# EAGLE design CentralLubrication_RevA (EAGLE 7.6.0)

## Sheet 1 of 5
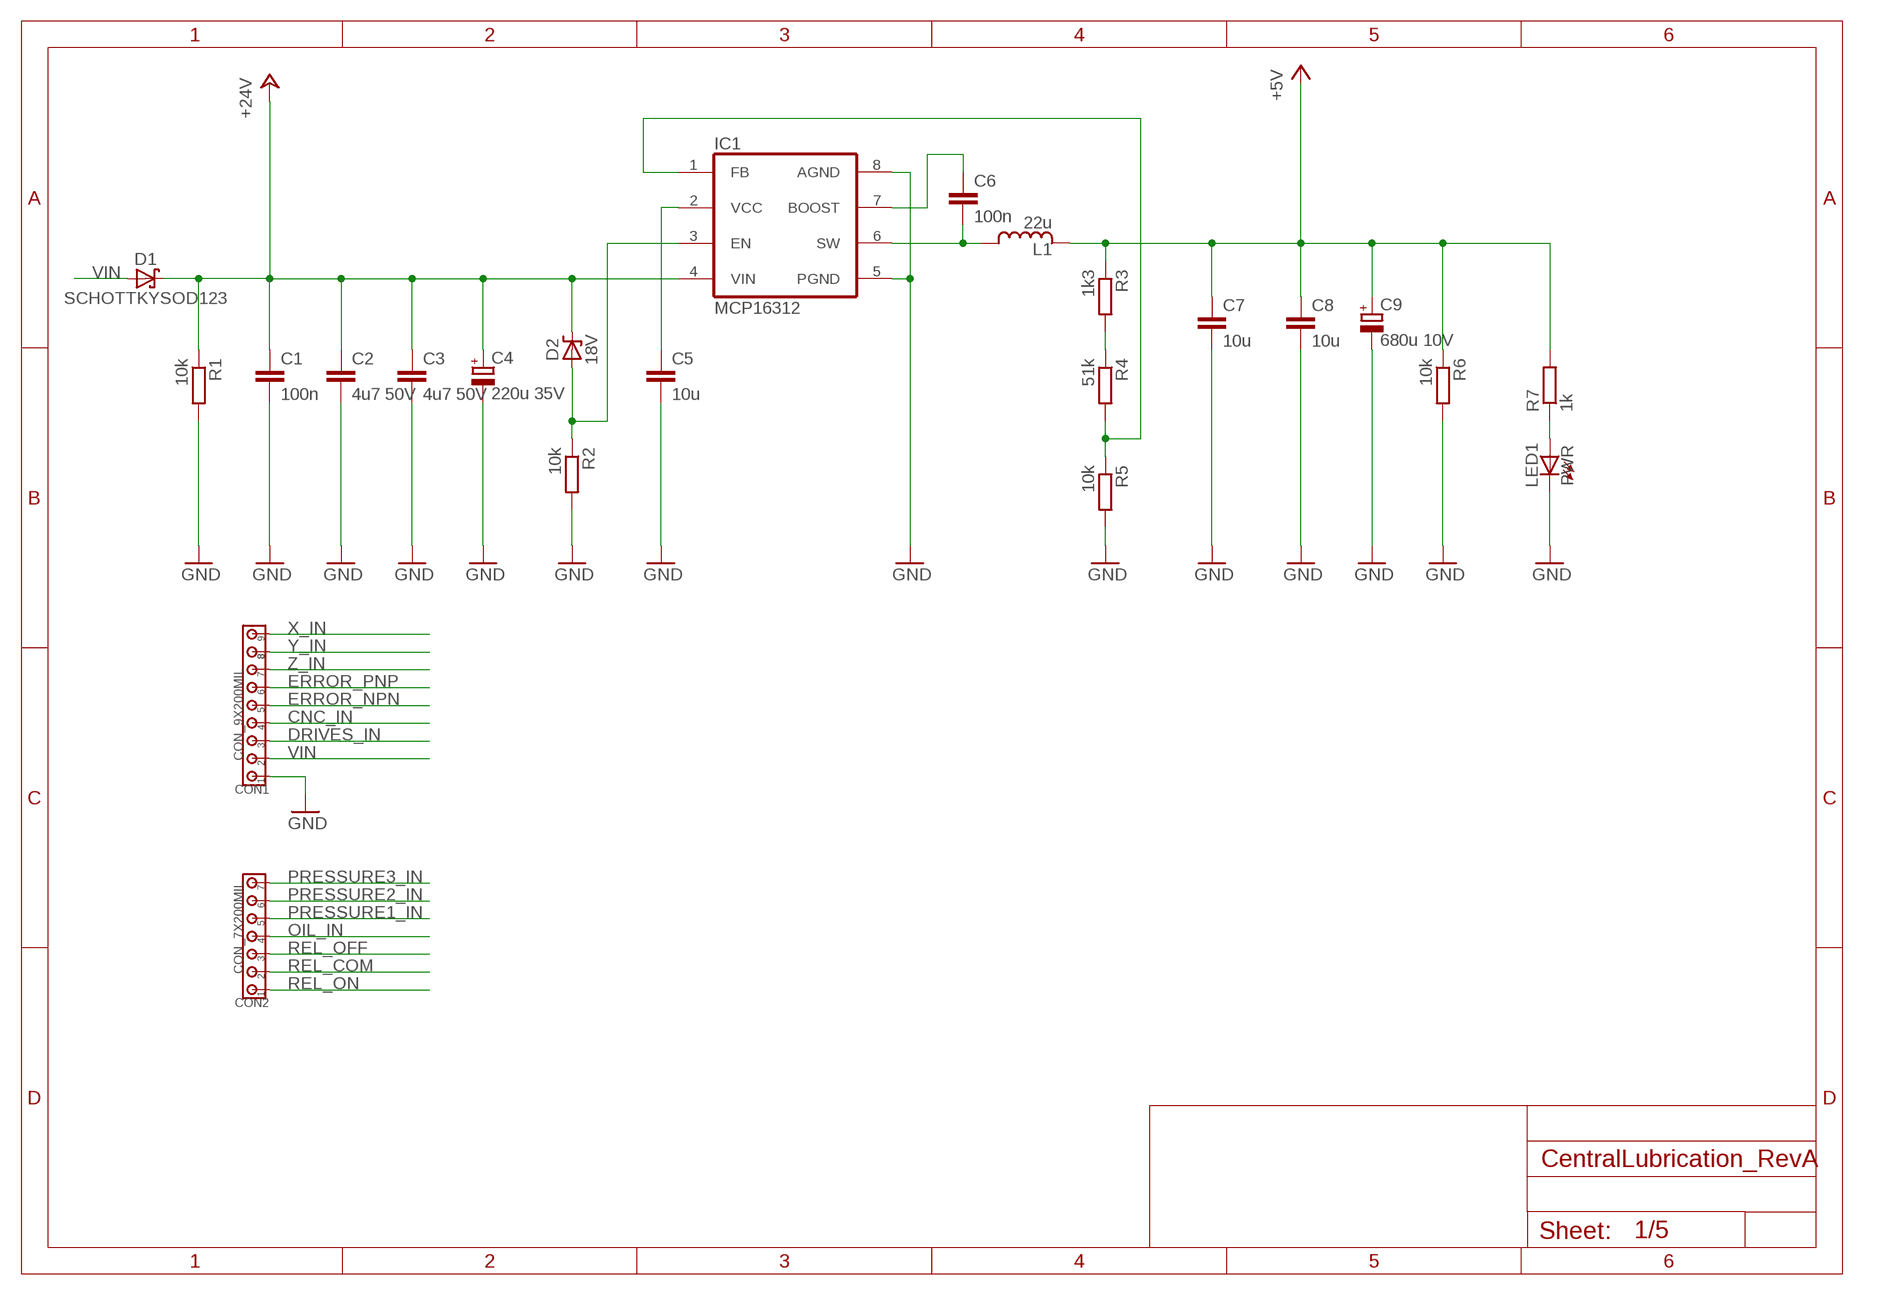
[diagram p0: schematic, sheet 1]

### Parts
C1  100n  CC0805  [C0805]
C2  4u7 50V  CC1206  [C1206]
C3  4u7 50V  CC1206  [C1206]
C4  220u 35V  C_POLARIZED8MM  [8MM]
C5  10u  CC0805  [C0805]
C6  100n  CC0805  [C0805]
C7  10u  CC0805  [C0805]
C8  10u  CC0805  [C0805]
C9  680u 10V  C_POLARIZED8MM  [8MM]
CON1  CON_9X200MIL  [200MIL_9X]
CON2  CON_7X200MIL  [200MIL_7X]
D1  SCHOTTKYSOD123  [SOD123]
D2  18V  ZENERSOD323  [SOD323]
IC1  MCP16312  MCP16311  [MSOP8]
L1  22u  INDUCTORLPS4018  [LPS4018]
LED1  PWR  LED0805_NB  [LED0805_NOBOARDER]
R1  10k  RESISTORR0805  [R0805]
R2  10k  RESISTORR0805  [R0805]
R3  1k3  RESISTORR0805  [R0805]
R4  51k  RESISTORR0805  [R0805]
R5  10k  RESISTORR0805  [R0805]
R6  10k  RESISTORR0805  [R0805]
R7  1k  RESISTORR0805  [R0805]

### Nets
+5V [+5v]: C7.1 C8.1 C9.+ L1.2 R3.1 R6.1 R7.2 ; also sheet 2,3,4,5
+24V [24V]: C1.1 C2.1 C3.1 C4.+ D1.C D2.C IC1.4(VIN) R1.1 ; also sheet 2
BOOST: C6.1 IC1.7(BOOST)
CNC_IN: CON1.4 ; also sheet 5
DRIVES_IN: CON1.3 ; also sheet 5
ERROR_NPN: CON1.5 ; also sheet 2
ERROR_PNP: CON1.6 ; also sheet 2
GND: C1.2 C2.2 C3.2 C4.- C5.2 C7.2 C8.2 C9.- CON1.1 IC1.5(PGND) IC1.8(AGND) LED1.C R1.2 R2.2 R5.2 R6.2 ; also sheet 2,3,4,5
N$1: IC1.1(FB) R4.2 R5.1
N$4: R3.2 R4.1
N$5: C5.1 IC1.2(VCC)
N$18: D2.A IC1.3(EN) R2.1
N$35: LED1.A R7.1
OIL_IN: CON2.4 ; also sheet 5
PRESSURE1_IN: CON2.5 ; also sheet 5
PRESSURE2_IN: CON2.6 ; also sheet 5
PRESSURE3_IN: CON2.7 ; also sheet 5
REL_COM [230V]: CON2.2 ; also sheet 2
REL_OFF [230V]: CON2.3 ; also sheet 2
REL_ON [230V]: CON2.1 ; also sheet 2
SWITCH1: C6.2 IC1.6(SW) L1.1
VIN [24V]: CON1.2 D1.A
X_IN: CON1.9 ; also sheet 4
Y_IN: CON1.8 ; also sheet 4
Z_IN: CON1.7 ; also sheet 4

## Sheet 2 of 5
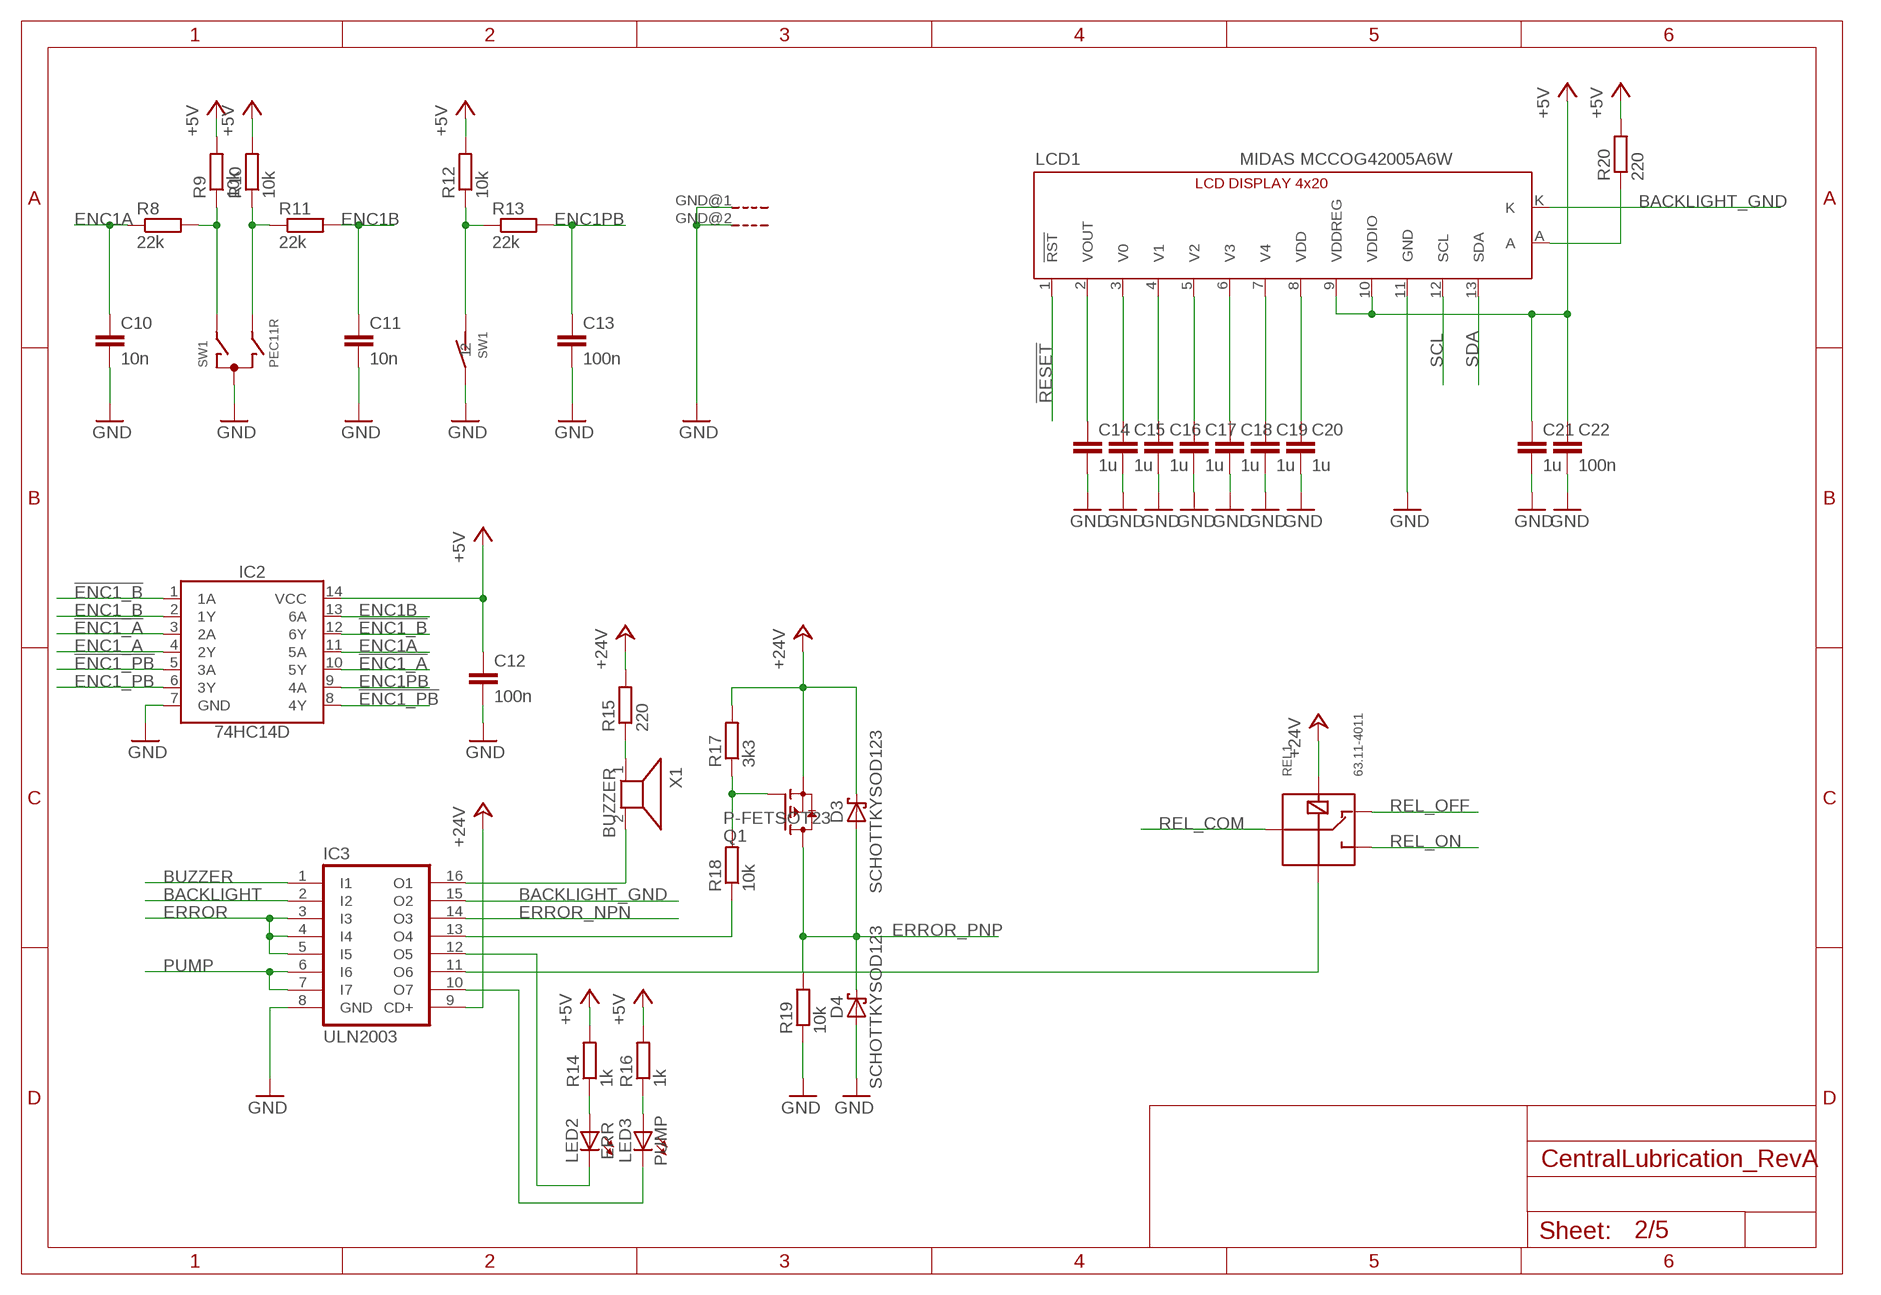
[diagram p1: schematic, sheet 2]

### Parts
C10  10n  CC0805  [C0805]
C11  10n  CC0805  [C0805]
C12  100n  CC0805  [C0805]
C13  100n  CC0805  [C0805]
C14  1u  CC0805  [C0805]
C15  1u  CC0805  [C0805]
C16  1u  CC0805  [C0805]
C17  1u  CC0805  [C0805]
C18  1u  CC0805  [C0805]
C19  1u  CC0805  [C0805]
C20  1u  CC0805  [C0805]
C21  1u  CC0805  [C0805]
C22  100n  CC0805  [C0805]
D3  SCHOTTKYSOD123  [SOD123]
D4  SCHOTTKYSOD123  [SOD123]
IC2  74HC14D  [SO14]
IC3  ULN2003  [SO16]
LCD1  MIDAS MCCOG42005A6W  LCD4X20_I2C  [LCD_4X20_I2C]
LED2  ERR  LED0805_NB  [LED0805_NOBOARDER]
LED3  PUMP  LED0805_NB  [LED0805_NOBOARDER]
Q1  P-FETSOT23  [SOT23]
R8  22k  RESISTORR0805  [R0805]
R9  10k  RESISTORR0805  [R0805]
R10  10k  RESISTORR0805  [R0805]
R11  22k  RESISTORR0805  [R0805]
R12  10k  RESISTORR0805  [R0805]
R13  22k  RESISTORR0805  [R0805]
R14  1k  RESISTORR0805  [R0805]
R15  220  RESISTORR0805  [R0805]
R16  1k  RESISTORR0805  [R0805]
R17  3k3  RESISTORR0805  [R0805]
R18  10k  RESISTORR0805  [R0805]
R19  10k  RESISTORR0805  [R0805]
R20  220  RESISTORR0805  [R0805]
REL1  63.11-4011  [G5LE]
SW1  PEC11R  ENCODER_BOURNS  [ENCODER_BOURNS]
X1  BUZZER  [BUZZER_14MM]

### Nets
!ENC1_A!: IC2.3(2A) IC2.10(5Y)
!ENC1_B!: IC2.1(1A) IC2.12(6Y)
!ENC1_PB!: IC2.5(3A) IC2.8(4Y)
!RESET!: LCD1.1(!RST!) ; also sheet 3
+5V [+5v]: C12.1 C21.1 C22.1 IC2.14(VCC) LCD1.9(VDDREG) LCD1.10(VDDIO) R9.2 R10.2 R12.2 R14.2 R16.2 R20.2 ; also sheet 1,3,4,5
+24V [24V]: D3.C IC3.9(CD+) Q1.2(S) R15.2 R17.2 REL1.2 ; also sheet 1
BACKLIGHT: IC3.2(I2) ; also sheet 3
BACKLIGHT_GND: IC3.15(O2) LCD1.K
BUZZER: IC3.1(I1) ; also sheet 3
BUZZER_GND: IC3.16(O1) X1.2
ENC1_A: IC2.4(2Y) ; also sheet 3
ENC1_B: IC2.2(1Y) ; also sheet 3
ENC1_PB: IC2.6(3Y) ; also sheet 3
ENC1A: C10.1 IC2.11(5A) R8.1
ENC1B: C11.1 IC2.13(6A) R11.2
ENC1PB: C13.1 IC2.9(4A) R13.2
ERROR: IC3.3(I3) IC3.4(I4) IC3.5(I5) ; also sheet 3
ERROR_NPN: IC3.14(O3) ; also sheet 1
ERROR_PNP: D3.A D4.C Q1.3(D) R19.2 ; also sheet 1
GND: C10.2 C11.2 C12.2 C13.2 C14.2 C15.2 C16.2 C17.2 C18.2 C19.2 C20.2 C21.2 C22.2 D4.A IC2.7(GND) IC3.8(GND) LCD1.11(GND) R19.1 SW1.2 SW1.C SW1.GND@1(G) SW1.GND@2(G) ; also sheet 1,3,4,5
N$2: C20.1 LCD1.8(VDD)
N$12: R15.1 X1.1
N$13: R10.1 R11.1 SW1.B
N$14: R8.2 R9.1 SW1.A
N$15: LCD1.A R20.1
N$16: IC3.11(O6) REL1.1
N$17: Q1.1(G) R17.1 R18.2
N$19: R12.1 R13.1 SW1.1
N$20: IC3.13(O4) R18.1
N$25: C14.1 LCD1.2(VOUT)
N$26: C15.1 LCD1.3(V0)
N$27: C19.1 LCD1.7(V4)
N$28: C18.1 LCD1.6(V3)
N$29: C17.1 LCD1.5(V2)
N$30: C16.1 LCD1.4(V1)
N$31: IC3.10(O7) LED3.C
N$32: LED2.A R14.1
N$33: LED3.A R16.1
N$34: IC3.12(O5) LED2.C
PUMP: IC3.6(I6) IC3.7(I7) ; also sheet 3
REL_COM [230V]: REL1.COM ; also sheet 1
REL_OFF [230V]: REL1.O ; also sheet 1
REL_ON [230V]: REL1.C ; also sheet 1
SCL: LCD1.12(SCL) ; also sheet 3
SDA: LCD1.13(SDA) ; also sheet 3

## Sheet 3 of 5
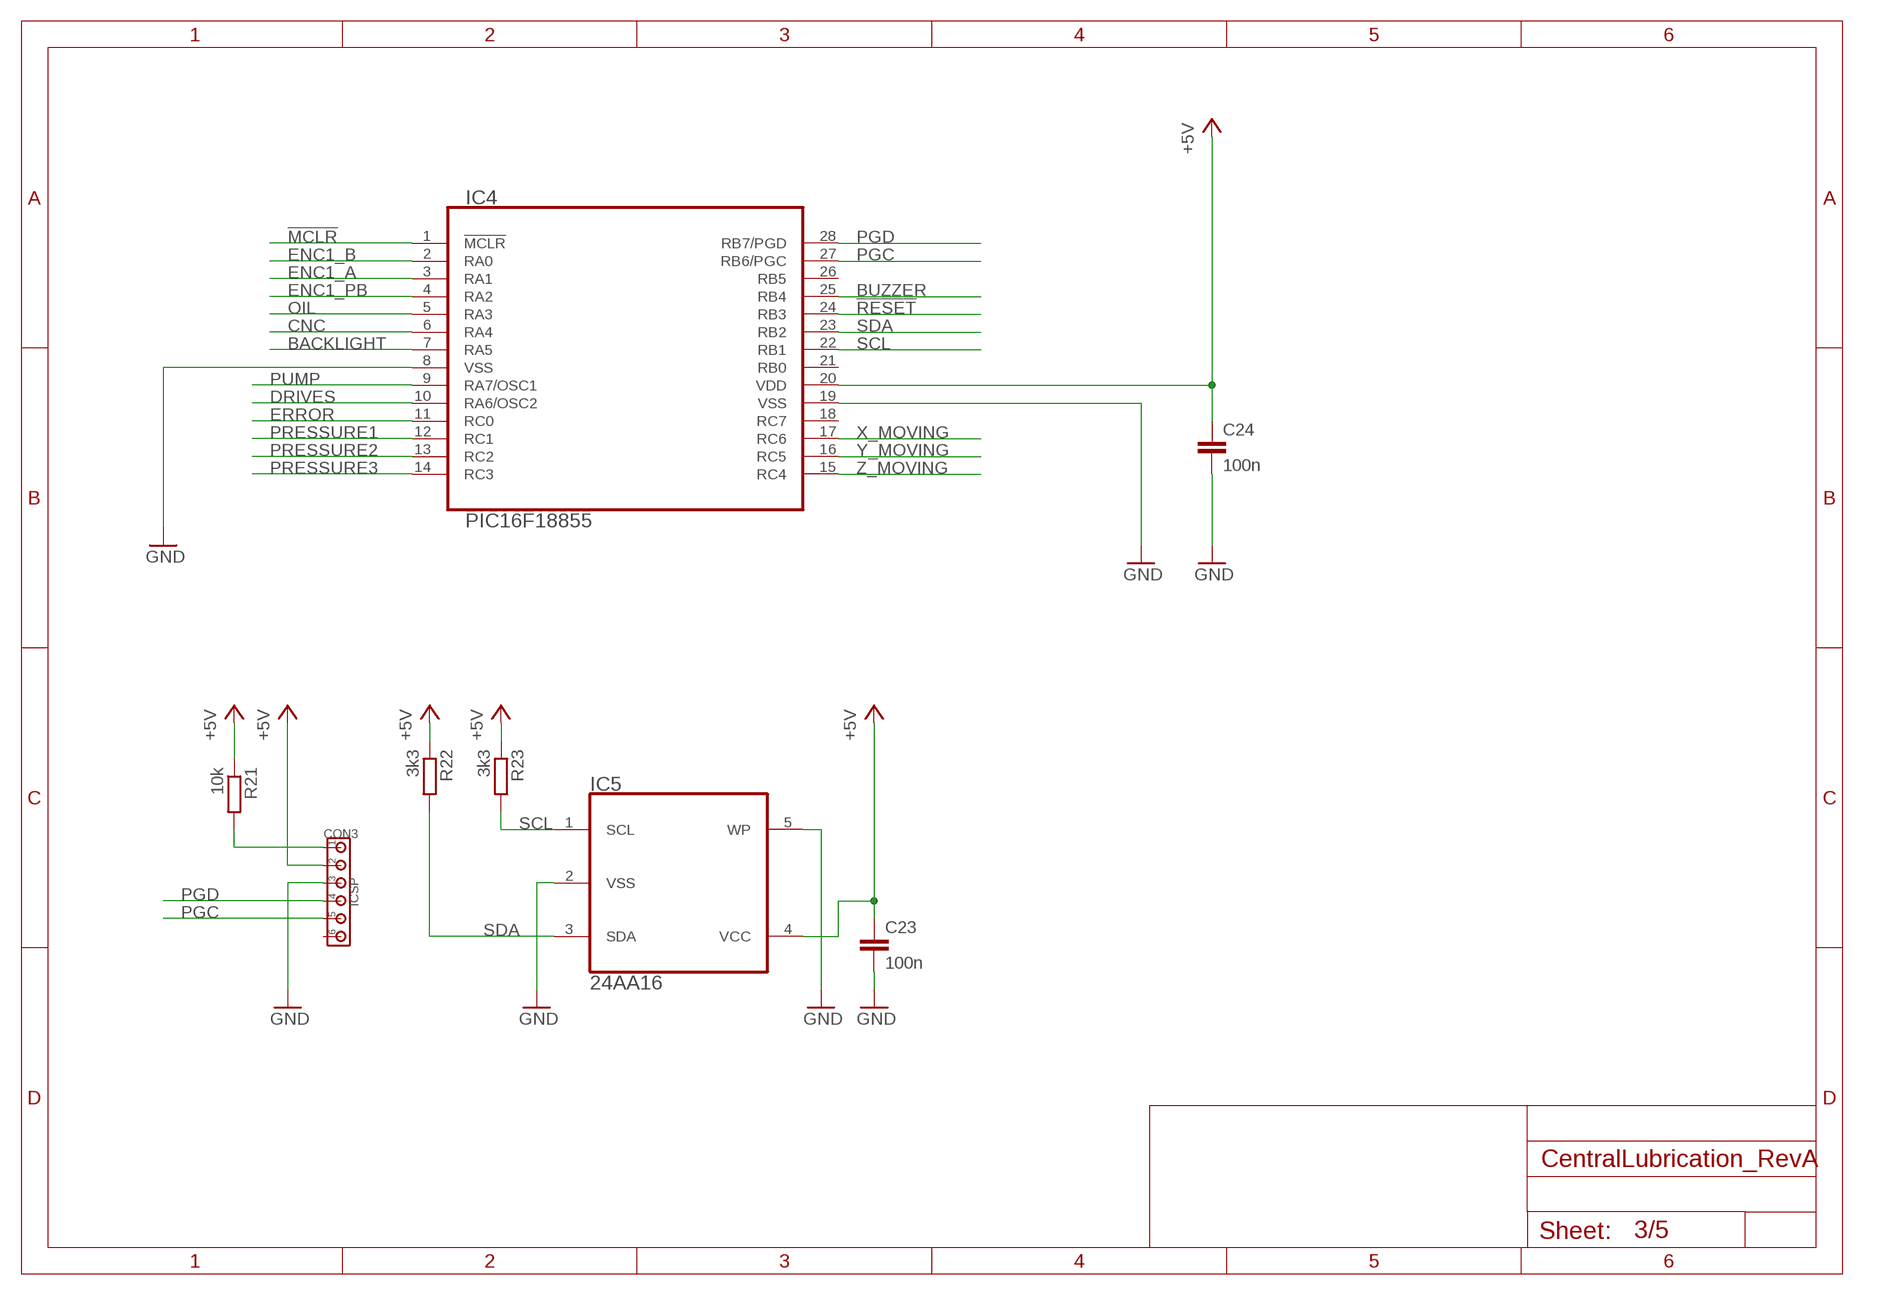
[diagram p2: schematic, sheet 3]

### Parts
C23  100n  CC0805  [C0805]
C24  100n  CC0805  [C0805]
CON3  ICSP  CON_6X100MIL  [100MIL_6X]
IC4  PIC16F18855  [SO28W]
IC5  24AA16  [SOT-23-5]
R21  10k  RESISTORR0805  [R0805]
R22  3k3  RESISTORR0805  [R0805]
R23  3k3  RESISTORR0805  [R0805]

### Nets
!MCLR!: CON3.1 IC4.1(!MCLR!) R21.2
!RESET!: IC4.24(RB3) ; also sheet 2
+5V [+5v]: C23.1 C24.1 CON3.2 IC4.20(VDD) IC5.4(VCC) R21.1 R22.1 R23.1 ; also sheet 1,2,4,5
BACKLIGHT: IC4.7(RA5) ; also sheet 2
BUZZER: IC4.25(RB4) ; also sheet 2
CNC: IC4.6(RA4) ; also sheet 5
DRIVES: IC4.10(RA6/OSC2) ; also sheet 5
ENC1_A: IC4.3(RA1) ; also sheet 2
ENC1_B: IC4.2(RA0) ; also sheet 2
ENC1_PB: IC4.4(RA2) ; also sheet 2
ERROR: IC4.11(RC0) ; also sheet 2
GND: C23.2 C24.2 CON3.3 IC4.8(VSS) IC4.19(VSS) IC5.2(VSS) IC5.5(WP) ; also sheet 1,2,4,5
OIL: IC4.5(RA3) ; also sheet 5
PGC: CON3.5 IC4.27(RB6/PGC)
PGD: CON3.4 IC4.28(RB7/PGD)
PRESSURE1: IC4.12(RC1) ; also sheet 5
PRESSURE2: IC4.13(RC2) ; also sheet 5
PRESSURE3: IC4.14(RC3) ; also sheet 5
PUMP: IC4.9(RA7/OSC1) ; also sheet 2
SCL: IC4.22(RB1) IC5.1(SCL) R23.2 ; also sheet 2
SDA: IC4.23(RB2) IC5.3(SDA) R22.2 ; also sheet 2
X_MOVING: IC4.17(RC6) ; also sheet 4
Y_MOVING: IC4.16(RC5) ; also sheet 4
Z_MOVING: IC4.15(RC4) ; also sheet 4
Unconnected: CON3.6 IC4.18(RC7) IC4.21(RB0) IC4.26(RB5)

## Sheet 4 of 5
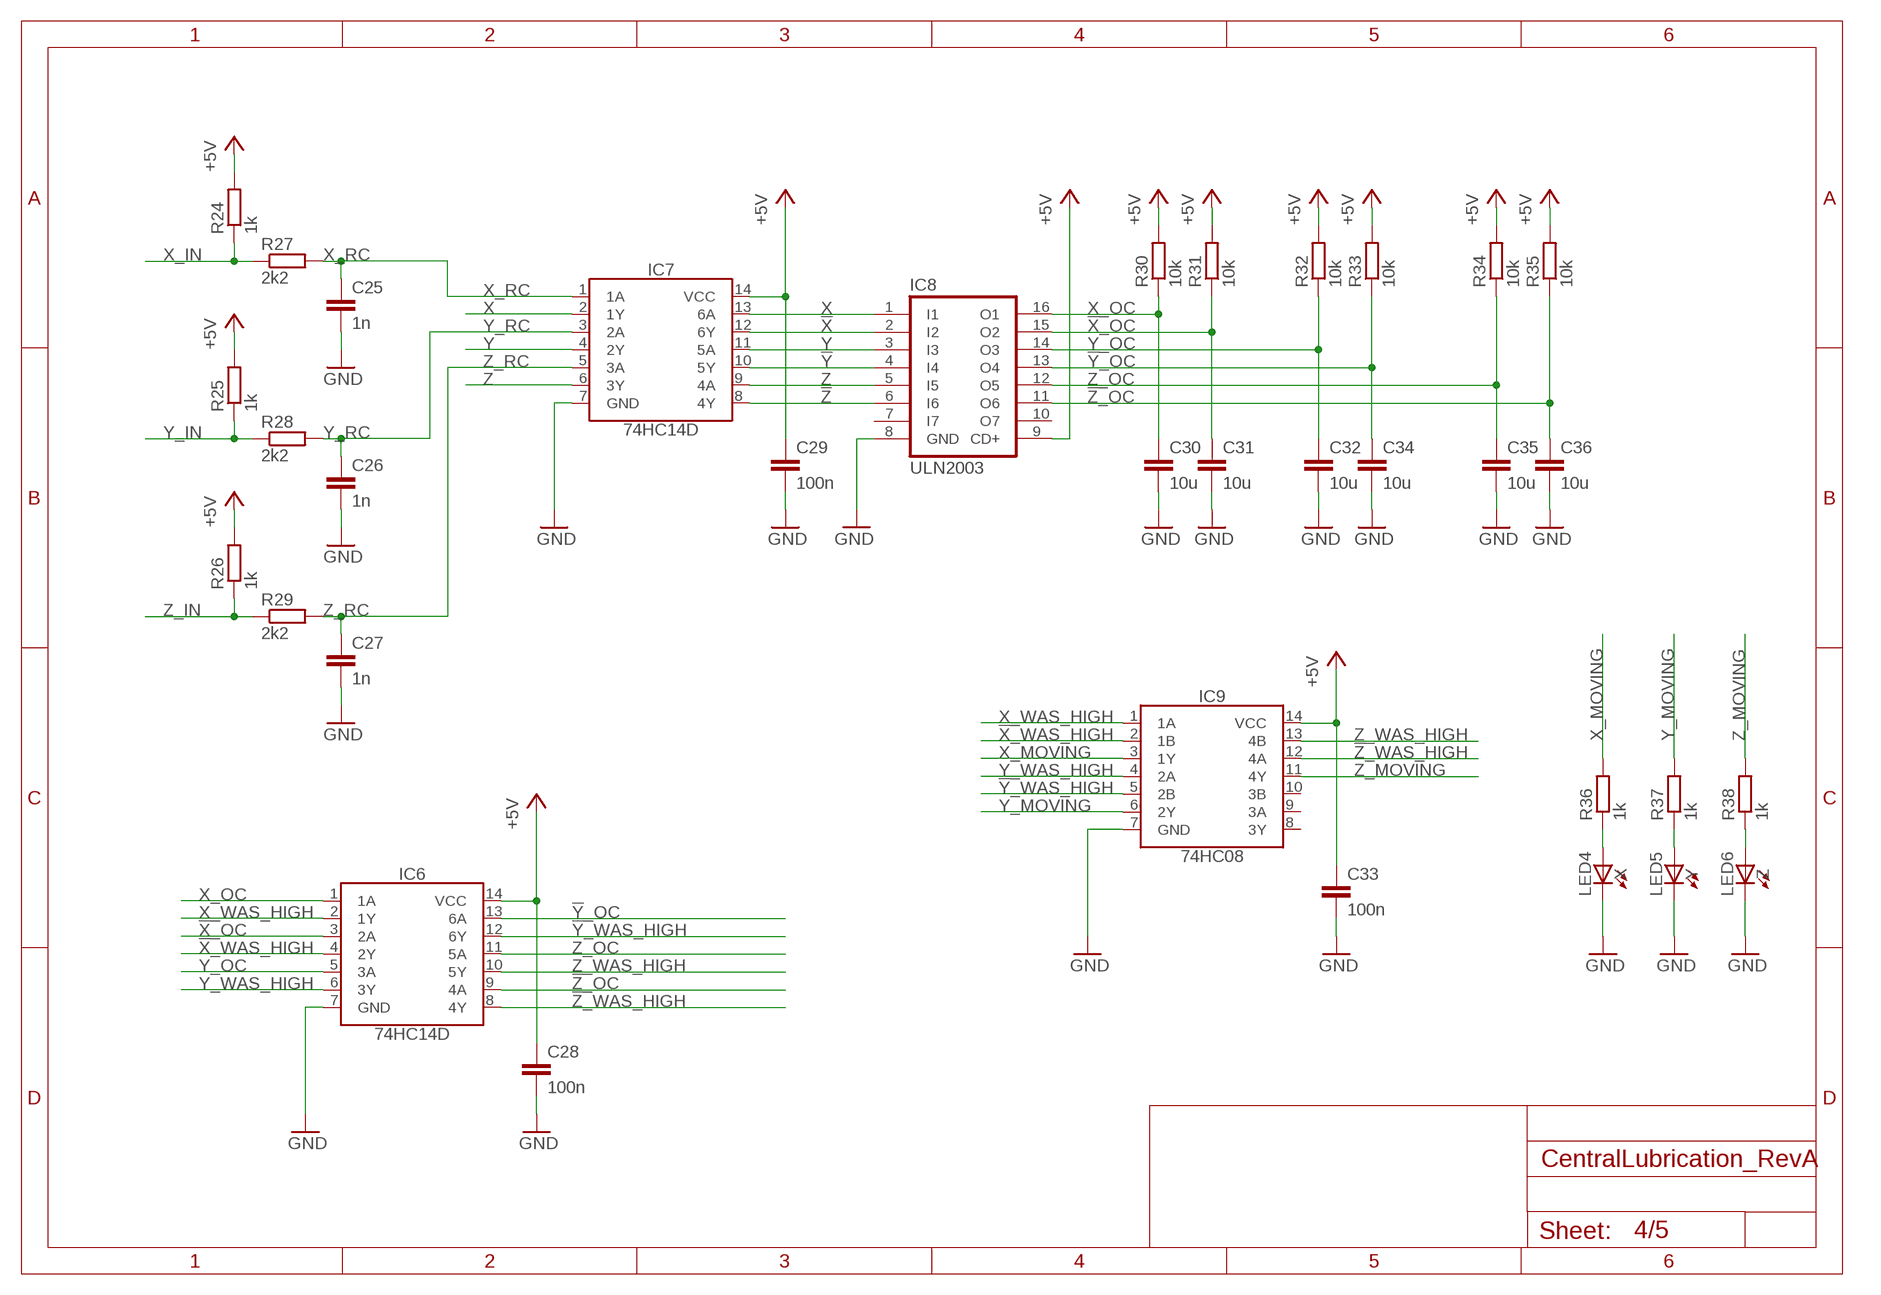
[diagram p3: schematic, sheet 4]

### Parts
C25  1n  CC0805  [C0805]
C26  1n  CC0805  [C0805]
C27  1n  CC0805  [C0805]
C28  100n  CC0805  [C0805]
C29  100n  CC0805  [C0805]
C30  10u  CC0805  [C0805]
C31  10u  CC0805  [C0805]
C32  10u  CC0805  [C0805]
C33  100n  CC0805  [C0805]
C34  10u  CC0805  [C0805]
C35  10u  CC0805  [C0805]
C36  10u  CC0805  [C0805]
IC6  74HC14D  [SO14]
IC7  74HC14D  [SO14]
IC8  ULN2003  [SO16]
IC9  74HC08  [SO14]
LED4  X  LED0805_NB  [LED0805_NOBOARDER]
LED5  Y  LED0805_NB  [LED0805_NOBOARDER]
LED6  Z  LED0805_NB  [LED0805_NOBOARDER]
R24  1k  RESISTORR0805  [R0805]
R25  1k  RESISTORR0805  [R0805]
R26  1k  RESISTORR0805  [R0805]
R27  2k2  RESISTORR0805  [R0805]
R28  2k2  RESISTORR0805  [R0805]
R29  2k2  RESISTORR0805  [R0805]
R30  10k  RESISTORR0805  [R0805]
R31  10k  RESISTORR0805  [R0805]
R32  10k  RESISTORR0805  [R0805]
R33  10k  RESISTORR0805  [R0805]
R34  10k  RESISTORR0805  [R0805]
R35  10k  RESISTORR0805  [R0805]
R36  1k  RESISTORR0805  [R0805]
R37  1k  RESISTORR0805  [R0805]
R38  1k  RESISTORR0805  [R0805]

### Nets
!X!: IC7.12(6Y) IC8.2(I2)
!X!_OC: C31.1 IC6.3(2A) IC8.15(O2) R31.1
!X!_WAS_HIGH: IC6.4(2Y) IC9.2(1B)
!Y!: IC7.10(5Y) IC8.4(I4)
!Y!_OC: C34.1 IC6.13(6A) IC8.13(O4) R33.1
!Y!_WAS_HIGH: IC6.12(6Y) IC9.5(2B)
!Z!: IC7.8(4Y) IC8.6(I6)
!Z!_OC: C36.1 IC6.9(4A) IC8.11(O6) R35.1
!Z!_WAS_HIGH: IC6.8(4Y) IC9.12(4A)
+5V [+5v]: C28.1 C29.1 C33.1 IC6.14(VCC) IC7.14(VCC) IC8.9(CD+) IC9.14(VCC) R24.2 R25.2 R26.2 R30.2 R31.2 R32.2 R33.2 R34.2 R35.2 ; also sheet 1,2,3,5
GND: C25.2 C26.2 C27.2 C28.2 C29.2 C30.2 C31.2 C32.2 C33.2 C34.2 C35.2 C36.2 IC6.7(GND) IC7.7(GND) IC8.8(GND) IC9.7(GND) LED4.C LED5.C LED6.C ; also sheet 1,2,3,5
N$6: LED4.A R36.1
N$8: LED5.A R37.1
N$11: LED6.A R38.1
X: IC7.2(1Y) IC7.13(6A) IC8.1(I1)
X_IN: R24.1 R27.1 ; also sheet 1
X_MOVING: IC9.3(1Y) R36.2 ; also sheet 3
X_OC: C30.1 IC6.1(1A) IC8.16(O1) R30.1
X_RC: C25.1 IC7.1(1A) R27.2
X_WAS_HIGH: IC6.2(1Y) IC9.1(1A)
Y: IC7.4(2Y) IC7.11(5A) IC8.3(I3)
Y_IN: R25.1 R28.1 ; also sheet 1
Y_MOVING: IC9.6(2Y) R37.2 ; also sheet 3
Y_OC: C32.1 IC6.5(3A) IC8.14(O3) R32.1
Y_RC: C26.1 IC7.3(2A) R28.2
Y_WAS_HIGH: IC6.6(3Y) IC9.4(2A)
Z: IC7.6(3Y) IC7.9(4A) IC8.5(I5)
Z_IN: R26.1 R29.1 ; also sheet 1
Z_MOVING: IC9.11(4Y) R38.2 ; also sheet 3
Z_OC: C35.1 IC6.11(5A) IC8.12(O5) R34.1
Z_RC: C27.1 IC7.5(3A) R29.2
Z_WAS_HIGH: IC6.10(5Y) IC9.13(4B)
Unconnected: IC8.7(I7) IC8.10(O7) IC9.8(3Y) IC9.9(3A) IC9.10(3B)

## Sheet 5 of 5
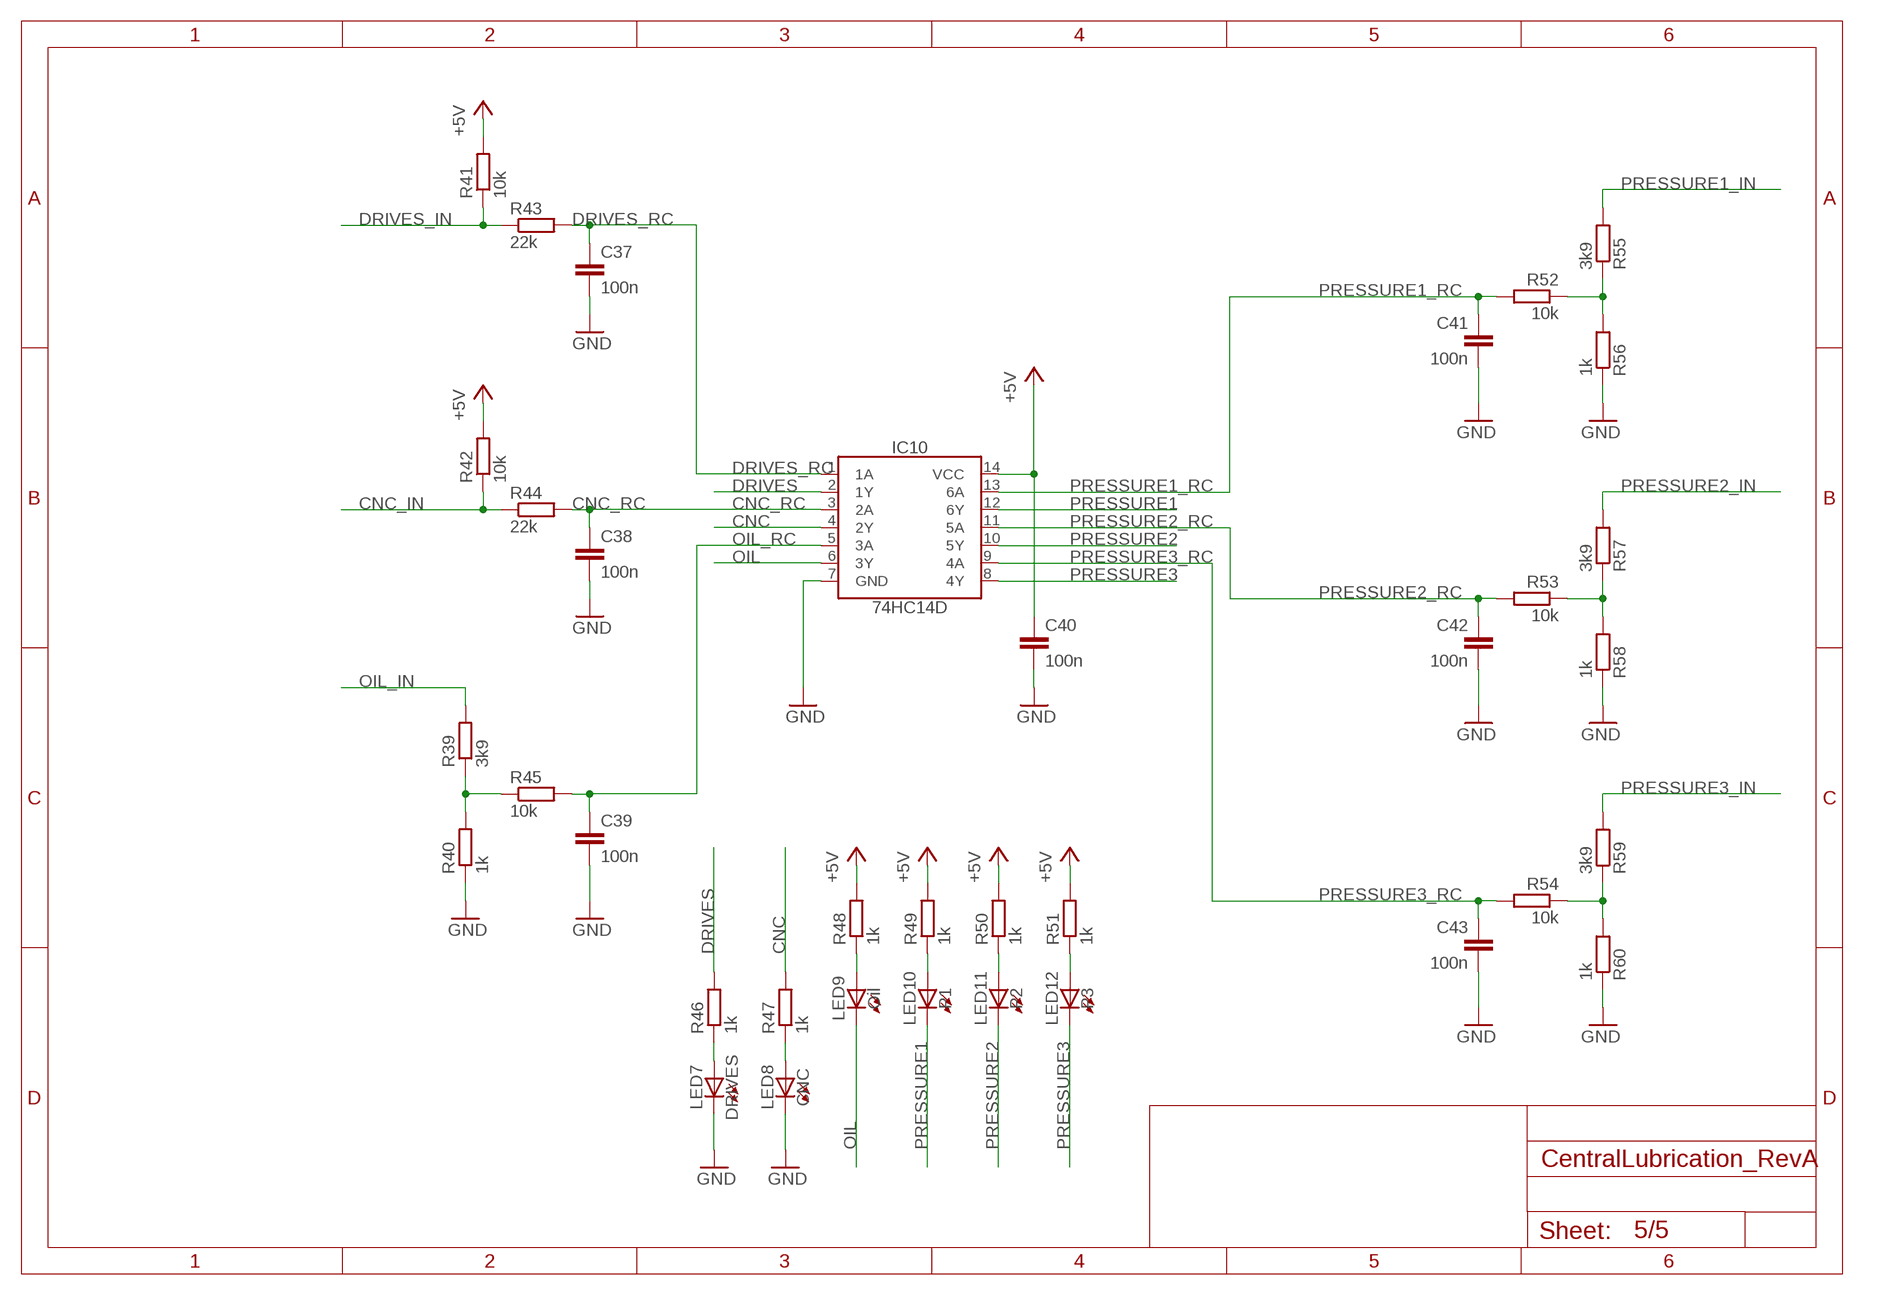
[diagram p4: schematic, sheet 5]

### Parts
C37  100n  CC0805  [C0805]
C38  100n  CC0805  [C0805]
C39  100n  CC0805  [C0805]
C40  100n  CC0805  [C0805]
C41  100n  CC0805  [C0805]
C42  100n  CC0805  [C0805]
C43  100n  CC0805  [C0805]
IC10  74HC14D  [SO14]
LED7  DRIVES  LED0805_NB  [LED0805_NOBOARDER]
LED8  CNC  LED0805_NB  [LED0805_NOBOARDER]
LED9  Oil  LED0805_NB  [LED0805_NOBOARDER]
LED10  P1  LED0805_NB  [LED0805_NOBOARDER]
LED11  P2  LED0805_NB  [LED0805_NOBOARDER]
LED12  P3  LED0805_NB  [LED0805_NOBOARDER]
R39  3k9  RESISTORR0805  [R0805]
R40  1k  RESISTORR0805  [R0805]
R41  10k  RESISTORR0805  [R0805]
R42  10k  RESISTORR0805  [R0805]
R43  22k  RESISTORR0805  [R0805]
R44  22k  RESISTORR0805  [R0805]
R45  10k  RESISTORR0805  [R0805]
R46  1k  RESISTORR0805  [R0805]
R47  1k  RESISTORR0805  [R0805]
R48  1k  RESISTORR0805  [R0805]
R49  1k  RESISTORR0805  [R0805]
R50  1k  RESISTORR0805  [R0805]
R51  1k  RESISTORR0805  [R0805]
R52  10k  RESISTORR0805  [R0805]
R53  10k  RESISTORR0805  [R0805]
R54  10k  RESISTORR0805  [R0805]
R55  3k9  RESISTORR0805  [R0805]
R56  1k  RESISTORR0805  [R0805]
R57  3k9  RESISTORR0805  [R0805]
R58  1k  RESISTORR0805  [R0805]
R59  3k9  RESISTORR0805  [R0805]
R60  1k  RESISTORR0805  [R0805]

### Nets
+5V [+5v]: C40.1 IC10.14(VCC) R41.2 R42.2 R48.2 R49.2 R50.2 R51.2 ; also sheet 1,2,3,4
CNC: IC10.4(2Y) R47.2 ; also sheet 3
CNC_IN: R42.1 R44.1 ; also sheet 1
CNC_RC: C38.1 IC10.3(2A) R44.2
DRIVES: IC10.2(1Y) R46.2 ; also sheet 3
DRIVES_IN: R41.1 R43.1 ; also sheet 1
DRIVES_RC: C37.1 IC10.1(1A) R43.2
GND: C37.2 C38.2 C39.2 C40.2 C41.2 C42.2 C43.2 IC10.7(GND) LED7.C LED8.C R40.1 R56.1 R58.1 R60.1 ; also sheet 1,2,3,4
N$21: R39.1 R40.2 R45.1
N$22: R52.1 R55.1 R56.2
N$23: R53.1 R57.1 R58.2
N$24: R54.1 R59.1 R60.2
N$36: LED7.A R46.1
N$37: LED8.A R47.1
N$38: LED9.A R48.1
N$39: LED10.A R49.1
N$40: LED11.A R50.1
N$41: LED12.A R51.1
OIL: IC10.6(3Y) LED9.C ; also sheet 3
OIL_IN: R39.2 ; also sheet 1
OIL_RC: C39.1 IC10.5(3A) R45.2
PRESSURE1: IC10.12(6Y) LED10.C ; also sheet 3
PRESSURE1_IN: R55.2 ; also sheet 1
PRESSURE1_RC: C41.1 IC10.13(6A) R52.2
PRESSURE2: IC10.10(5Y) LED11.C ; also sheet 3
PRESSURE2_IN: R57.2 ; also sheet 1
PRESSURE2_RC: C42.1 IC10.11(5A) R53.2
PRESSURE3: IC10.8(4Y) LED12.C ; also sheet 3
PRESSURE3_IN: R59.2 ; also sheet 1
PRESSURE3_RC: C43.1 IC10.9(4A) R54.2

## Library data of the parts
C1-C3 C5-C8 C10-C43 = 00Capacitor:C: Capacitor
C4 C9 = 00Capacitor:C_POLARIZED
CON1 = 00Connector:CON_9X: 9-pin header
CON2 = 00Connector:CON_7X: 7-pin header
CON3 = 00Connector:CON_6X: 6-pin header
D1 D3 D4 = 00Diode:SCHOTTKY
D2 = 00Diode:ZENER
IC1 = 00VoltageRegulator:MCP16311
IC2 IC6 IC7 IC10 = 00Logic:74HC14: Hex Inverter Schmitt Trigger
IC3 IC8 = 00Transistor:ULN2003: Seven Darlington array
IC4 = 00PIC:PIC16F18855
IC5 = 00Logic:24AA16: 16K I2C Serial EEPROM
IC9 = 00Logic:74HC08: Quad 2-input AND gate
L1 = 00Inductor:INDUCTOR
LCD1 = 00Display:LCD4X20_I2C: 4x20 character LCD display with I2C interface
LED1-LED12 = 00Display:LED: LED
Q1 = 00Mosfet:P-FET
R1-R60 = 00Resistor:RESISTOR: RESISTOR, European symbol
REL1 = 00Switch:63.11-4011: SPDT Relay
SW1 = 00Switch:ENCODER_BOURNS: Bourns Rotary Encoder with Switch PEC11-4xxxF-Sxxxx
X1 = 00MyParts:BUZZER

## Net classes
0 default: width 0.305 mm, drill 0.4 mm, clearance 0.203 mm
1 24V: width 0.61 mm, drill 0.6 mm, clearance 0.305 mm to class 0, clearance 0.305 mm
2 230V: width 1.016 mm, drill 0.8 mm, clearance 0.8 mm to class 0, clearance 0.8 mm to class 1, clearance 0.8 mm
5 +5v: width 0.61 mm, drill 0.6 mm, clearance 0.254 mm to class 0, clearance 0.254 mm to class 1, clearance 0.254 mm to class 2, clearance 0.254 mm to class 3, clearance 0.254 mm to class 4, clearance 0.254 mm

## Board
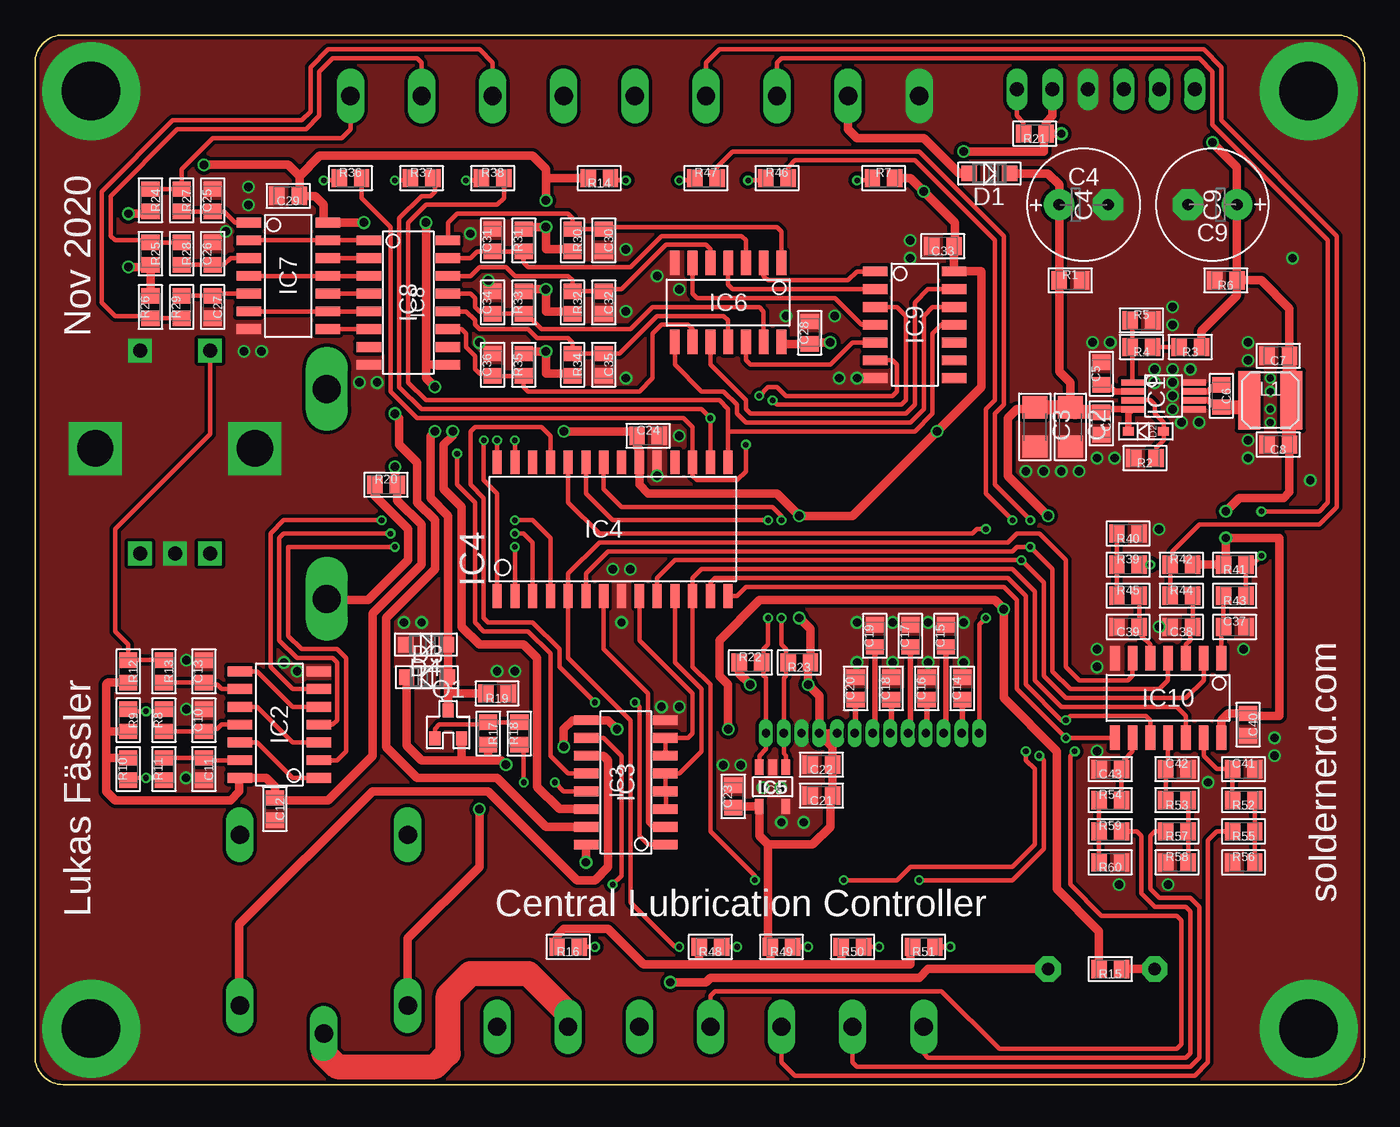
[diagram p5: board, top side]
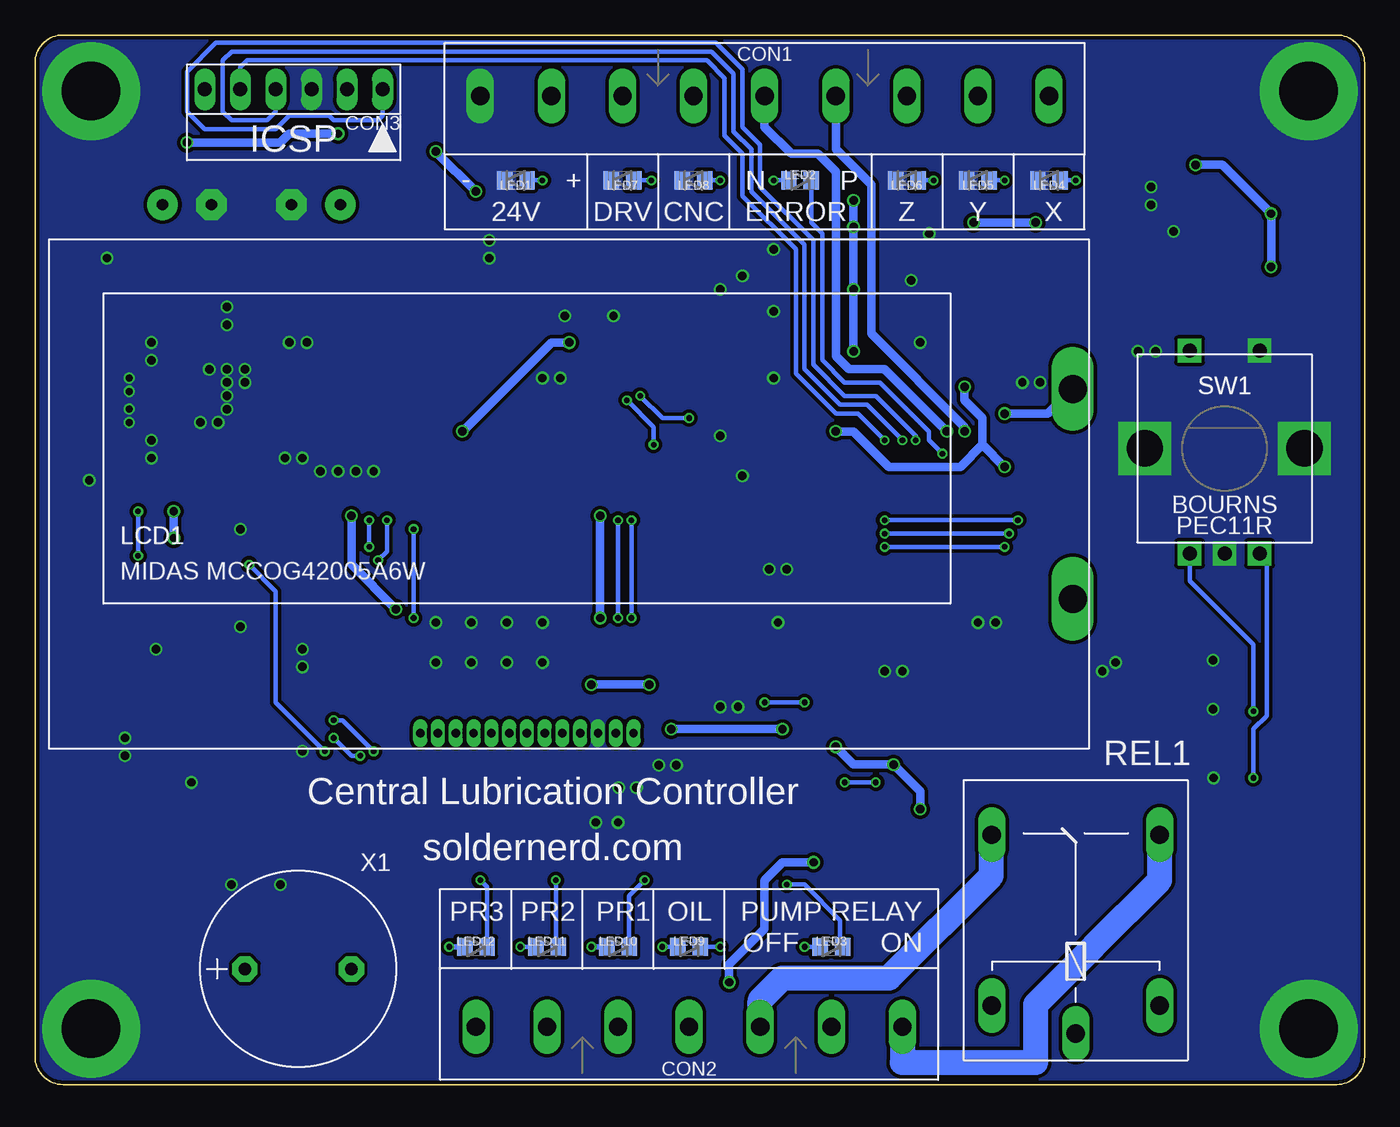
[diagram p6: board, bottom side, seen from below]

Size 95 x 75 mm. Coordinates in mm from the lower left corner, seen from the top.
Outline: 93,0 arc90 95,2 95,73 arc90 93,75 2,75 arc90 0,73 0,2 arc90 2,0 93,0
Copper layers (1*16): Top 0.035mm / dielectric 1.5mm / Bottom 0.035mm
Design rules "dirt_cheap_dirty_boards.6mil": minimum track width 6mil, minimum drill 12mil, track to track 6mil, track to pad 6mil, pad to pad 6mil, via to via 6mil, smd to smd 0mil, copper to edge 10mil, drill to drill 10mil, minimum pad ring 8mil, minimum via ring 6mil, stop-mask expansion 2mil, vias tented up to drill 25mil, thermal gap 10mil

### Footprints (pad centres in the part's own frame; a part is rotated, then mirrored left to right if it is on the bottom)
C0805 = smd 1.1 x 1.3: 1 -0.8,0; 2 0.8,0
C1206 = smd 1.6 x 1.8: 1 -1.4,0; 2 1.4,0
8MM = drill 0.8 pad 2.2: + -1.75,0 | drill 0.8 pad 2.2 octagon: - 1.75,0
200MIL_9X = drill 1.3 long: 1 -20.32,0; 2 -15.24,0; 3 -10.16,0; 4 -5.08,0; 5 0,0; 6 5.08,0; 7 10.16,0; 8 15.24,0; 9 20.32,0
200MIL_7X = drill 1.3 long: 1 -15.24,0; 2 -10.16,0; 3 -5.08,0; 4 0,0; 5 5.08,0; 6 10.16,0; 7 15.24,0
100MIL_6X = drill 1 long: 1 -6.35,0; 2 -3.81,0; 3 -1.27,0; 4 1.27,0; 5 3.81,0; 6 6.35,0
SOD123 = smd 1.1 x 1.1: A 1.45,0; C -1.45,0
SOD323 = smd 0.8 x 0.6: A 1.25,0; C -1.25,0
MSOP8 = smd 1.65 x 0.45: 1 -2.2,0.953; 2 -2.2,0.318; 3 -2.2,-0.318; 4 -2.2,-0.953; 5 2.2,-0.953; 6 2.2,-0.318; 7 2.2,0.318; 8 2.2,0.953
SO14 = smd 0.7 x 1.75: 1 -3.81,-2.825; 2 -2.54,-2.825; 3 -1.27,-2.825; 4 0,-2.825; 5 1.27,-2.825; 6 2.54,-2.825; 7 3.81,-2.825; 8 3.81,2.825; 9 2.54,2.825; 10 1.27,2.825; 11 0,2.825; 12 -1.27,2.825; 13 -2.54,2.825; 14 -3.81,2.825
SO16 = smd 0.7 x 1.75: 1 -4.445,-2.825; 2 -3.175,-2.825; 3 -1.905,-2.825; 4 -0.635,-2.825; 5 0.635,-2.825; 6 1.905,-2.825; 7 3.175,-2.825; 8 4.445,-2.825; 9 4.445,2.825; 10 3.175,2.825; 11 1.905,2.825; 12 0.635,2.825; 13 -0.635,2.825; 14 -1.905,2.825; 15 -3.175,2.825; 16 -4.445,2.825
SO28W = smd 0.65 x 1.7: 1 -7.62,-4.78; 2 -6.35,-4.78; 3 -5.08,-4.78; 4 -3.81,-4.78; 5 -2.54,-4.78; 6 -1.27,-4.78; 7 0,-4.78; 8 1.27,-4.78; 9 2.54,-4.78; 10 3.81,-4.78; 11 5.08,-4.78; 12 6.35,-4.78; 13 7.62,-4.78; 14 8.89,-4.78; 15 8.89,4.78; 16 7.62,4.78; 17 6.35,4.78; 18 5.08,4.78; 19 3.81,4.78; 20 2.54,4.78; 21 1.27,4.78; 22 0,4.78; 23 -1.27,4.78; 24 -2.54,4.78; 25 -3.81,4.78; 26 -5.08,4.78; 27 -6.35,4.78; 28 -7.62,4.78
SOT-23-5 = smd 0.6 x 1.1: 1 -0.95,-1.4; 2 0,-1.4; 3 0.95,-1.4; 4 0.95,1.4; 5 -0.95,1.4
LPS4018 = smd 1.6 x 4.2: 1 -1.5,0; 2 1.5,0
LCD_4X20_I2C = drill 0.6 pad 0.9 long: 1 26.53,1.1; 2 27.8,1.1; 3 29.07,1.1; 4 30.34,1.1; 5 31.61,1.1; 6 32.88,1.1; 7 34.15,1.1; 8 35.42,1.1; 9 36.69,1.1; 10 37.96,1.1; 11 39.23,1.1; 12 40.5,1.1; 13 41.77,1.1 | drill 2 long: A 73.15,10.7; K 73.15,25.7
LED0805_NOBOARDER = smd 1.1 x 1.3: A -0.8,0; C 0.8,0
SOT23 = smd 0.8 x 1: 1 -0.95,-1; 2 0.95,-1; 3 0,1
R0805 = smd 1.1 x 1.3: 1 -0.8,0; 2 0.8,0
G5LE = drill 1.3 long: 1 -6.1,-6; 2 -6.1,6; C 6.1,-6; COM -8.1,0; O 6.1,6
ENCODER_BOURNS = drill 1 pad 1.7 square: 1 -2.5,7; 2 2.5,7; A -2.5,-7.5; B 2.5,-7.5; C 0,-7.5 | drill 2.6 pad 3.8 square: GND@1 -5.7,0; GND@2 5.7,0
BUZZER_14MM = drill 0.9 pad 1.8 octagon: 1 -3.81,0; 2 3.81,0

### Placement (x,y rotation side)
C1  76.19,47.24 270 top
C2  73.98,46.99 270 top
C3  71.44,46.99 270 top
C4  74.93,62.87 0 top
C5  76.2,50.8 90 top
C6  84.77,49.21 270 top
C7  88.83,52.08 180 top
C8  88.83,45.73 180 top
C9  84.14,62.87 180 top
C10  12.06,26.04 90 top
C11  12.06,22.54 270 top
C12  17.14,19.68 270 top
C13  12.06,29.53 90 top
C14  66.26,28.3 90 top
C15  65.09,32.07 90 top
C16  63.72,28.3 90 top
C17  62.55,32.07 90 top
C18  61.18,28.3 90 top
C19  60.01,32.07 90 top
C20  58.64,28.3 90 top
C21  56.2,20.64 180 top
C22  56.2,22.86 180 top
C23  49.9,20.59 90 top
C24  43.81,46.35 0 top
C25  12.7,63.18 90 top
C26  12.7,59.37 90 top
C27  12.7,55.56 270 top
C28  55.35,53.72 90 top
C29  18.1,63.5 180 top
C30  40.64,60.33 270 top
C31  32.7,60.33 90 top
C32  40.64,55.88 270 top
C33  64.87,59.91 180 top
C34  32.7,55.88 90 top
C35  40.64,51.44 270 top
C36  32.7,51.44 90 top
C37  85.72,32.7 0 top
C38  81.92,32.7 180 top
C39  78.11,32.7 180 top
C40  86.68,25.72 270 top
C41  86.36,22.54 0 top
C42  81.6,22.54 0 top
C43  76.83,22.54 180 top
CON1  42.86,70.64 0 bottom
CON2  48.26,4.13 180 bottom
CON3  76.52,71.12 180 bottom
D1  68.2,65.09 180 top
D2  79.38,46.67 0 top
D3  28,29.11 0 top
D4  27.94,31.43 180 top
IC1  80.64,49.21 0 top
IC2  17.46,25.72 90 top
IC3  42.23,21.59 90 top
IC4  40.64,39.69 0 top
IC5  52.7,21.27 180 top
IC6  49.53,55.88 180 top
IC7  18.1,57.78 270 top
IC8  26.67,55.88 270 top
IC9  62.87,54.29 270 top
IC10  80.96,27.62 180 top
L1  88.27,48.9 0 top
LCD1  94,24 0 bottom
LED1  60.64,64.61 180 bottom
LED2  40.32,64.61 0 bottom
LED3  38.1,9.84 0 bottom
LED4  22.54,64.61 180 bottom
LED5  27.62,64.61 180 bottom
LED6  32.7,64.61 180 bottom
LED7  53.02,64.61 180 bottom
LED8  47.94,64.61 180 bottom
LED9  48.26,9.84 0 bottom
LED10  53.34,9.84 0 bottom
LED11  58.42,9.84 0 bottom
LED12  63.5,9.84 0 bottom
Q1  29.53,25.72 0 top
R1  73.98,57.47 0 top
R2  79.31,44.77 180 top
R3  82.55,52.7 180 top
R4  79.06,52.7 180 top
R5  79.06,54.61 0 top
R6  85.09,57.47 180 top
R7  60.64,64.77 0 top
R8  9.21,26.04 90 top
R9  6.67,26.04 270 top
R10  6.67,22.54 90 top
R11  9.21,22.54 90 top
R12  6.67,29.53 270 top
R13  9.21,29.53 270 top
R14  40.32,64.77 180 top
R15  76.83,8.26 180 top
R16  38.1,9.84 180 top
R17  32.38,25.08 270 top
R18  34.61,25.08 90 top
R19  33.02,27.94 180 top
R20  25.08,42.86 0 top
R21  71.44,67.94 180 top
R22  51.12,30.16 0 top
R23  54.61,30.16 180 top
R24  8.26,63.18 270 top
R25  8.26,59.37 270 top
R26  8.26,55.56 90 top
R27  10.48,63.18 270 top
R28  10.48,59.37 270 top
R29  10.48,55.56 90 top
R30  38.42,60.33 270 top
R31  34.92,60.33 90 top
R32  38.42,55.88 270 top
R33  34.92,55.88 90 top
R34  38.42,51.44 270 top
R35  34.92,51.44 90 top
R36  22.54,64.77 0 top
R37  27.62,64.77 0 top
R38  32.7,64.77 0 top
R39  78.11,37.15 0 top
R40  78.11,39.37 180 top
R41  85.72,37.15 180 top
R42  81.92,37.15 0 top
R43  85.72,34.92 180 top
R44  81.92,34.92 0 top
R45  78.11,34.92 0 top
R46  53.02,64.77 0 top
R47  47.94,64.77 0 top
R48  48.26,9.84 180 top
R49  53.34,9.84 180 top
R50  58.42,9.84 180 top
R51  63.5,9.84 180 top
R52  86.36,20.32 180 top
R53  81.6,20.32 180 top
R54  76.83,20.32 0 top
R55  86.36,18.1 180 top
R56  86.36,15.88 0 top
R57  81.6,18.1 180 top
R58  81.6,15.88 0 top
R59  76.83,18.1 0 top
R60  76.83,15.88 180 top
REL1  20.64,11.75 90 bottom
SW1  10,45.45 0 bottom
X1  76.2,8.26 0 bottom

### Tracks (layer width: path | path; a pad name or v marks a point on that pad's centre or on a via)
!ENC1_A!
  Top 0.305: IC2.3 18.41,24.45 15.88,26.99 IC2.10
!ENC1_B!
  Top 0.305: IC2.1 18.41,21.91 15.88,24.45 IC2.12
!ENC1_PB!
  Top 0.305: IC2.5 18.41,26.99 15.88,29.53 IC2.8
!MCLR!  (via drill 0.4 pad 0.6)
  Top 0.305: R21.2 70.64,68.75 70.17,69.22 CON3.1 | IC4.1 33.02,42.23 32.07,43.18 v32.07,46.04
  Bottom 0.305: CON3.1 70.17,69.22 70.48,68.9 73.66,68.9 73.98,69.22 76.83,69.22 77.79,68.26 82.87,68.26 84.14,69.53 84.14,72.39 82.07,74.45 46.35,74.45 44.45,72.55 44.45,68.42 43.18,67.15 43.18,64.14 39.37,60.33 39.37,51.44 37.15,49.21 34.92,49.21 32.07,46.35 v32.07,46.04
!RESET!  (via drill 0.4 pad 0.6)
  Top 0.305: LCD1.1 67.47,32.86 v67.94,33.34 | v67.94,39.69 67.31,39.69 66.99,39.37 40.32,39.37 38.1,41.59 IC4.24
  Bottom 0.305: v67.94,33.34 v67.94,39.69
!X!
  Top 0.305: IC8.2 IC7.12
!X!_OC
  Top 0.305: IC8.15 31.11,59.05 31.59,59.52 C31.1 R31.1 34.92,58.74 35.24,58.42 42.55,58.42 44.77,60.64 50.48,60.64 50.8,60.33 IC6.3
!X!_WAS_HIGH
  Top 0.305: IC6.4 49.53,57.15 49.85,56.83 IC9.2
!Y!
  Top 0.305: IC8.4 IC7.10
!Y!_OC
  Top 0.305: IC8.13 31.11,56.52 31.43,56.2 31.43,55.56 31.75,55.24 32.54,55.24 C34.1 R33.1 35.09,55.08 36.2,53.98 42.55,53.98 44.13,55.56 51.75,55.56 52.07,55.24 IC6.13
!Y!_WAS_HIGH
  Top 0.305: IC6.12 50.8,51.75 51.12,51.44 56.83,51.44 58.42,53.02 IC9.5
!Z!
  Top 0.305: IC8.6 IC7.8
!Z!_OC
  Top 0.305: IC8.11 30.48,53.98 30.8,53.66 30.8,52.7 31.43,52.07 31.43,51.12 31.75,50.8 32.54,50.8 C36.1 R35.1 34.92,49.85 35.24,49.53 43.18,49.53 44.13,50.48 44.13,53.66 44.77,54.29 46.67,54.29 46.99,53.98 IC6.9
!Z!_WAS_HIGH
  Top 0.305: IC9.12 64.14,55.56 63.5,54.93 63.5,48.26 62.55,47.31 50.8,47.31 50.16,47.94 50.16,48.58 49.21,49.53 47.62,49.53 45.72,51.44 IC6.8
+5V  (via drill 0.6 pad 0.6)
  Top 0.61: R42.2 R41.2 85.09,37.15 v85.09,39.05 88.9,39.05 88.9,26.35 86.84,26.35 C40.1 85.25,26.52 84.77,26.04 IC10.14 | R24.2 8.26,62.23 v6.67,62.23 | v6.67,58.42 8.26,58.42 R25.2 R26.2 | 18.9,64.92 C29.1 20,63.5 20.64,62.87 20.64,61.59 IC7.14 v23.5,61.59 | 18.9,64.92 18.1,65.72 v12.06,65.72 | IC8.9 27.94,51.44 | 27.94,51.44 v27.94,61.59 | 34.92,60.96 R31.2 34.92,61.28 v36.51,61.28 36.51,59.69 38.42,59.69 R30.2 | R33.2 34.92,56.83 v36.51,56.83 36.51,55.24 38.42,55.24 R32.2 | R35.2 34.92,52.39 v36.51,52.39 36.51,50.8 38.42,50.8 R34.2 | v36.51,63.18 36.51,64.77 | 18.9,64.92 20.33,66.36 35.56,66.36 36.51,65.41 36.51,64.77 | R14.2 36.51,64.77 | IC6.14 53.48,52.92 C28.1 55.46,52.92 55.56,53.02 v56.83,53.02 | 65.67,58.12 C33.1 65.72,59.97 65.72,61.59 v63.5,63.82 62.55,64.77 R7.2 | 65.67,58.12 IC9.14 | R21.1 72.24,68.75 72.71,69.22 CON3.2 | LCD1.10 LCD1.9 | LCD1.10 57,24.14 C22.1 C21.1 56.83,20.47 56.83,18.41 55.56,17.14 52.39,17.14 | LCD1.10 56.04,27.78 v55.24,28.57 55.24,30 R23.1 55.41,32.54 v54.61,33.34 | R22.1 50.32,29.38 v51.12,28.57 | 27.94,51.44 27.94,50.48 v28.57,49.85 | R16.2 37.3,10.63 37.78,11.11 40.96,11.11 43.5,8.57 47.62,8.57 | 47.62,8.57 52.54,8.57 | 52.54,8.57 57.47,8.57 | 57.47,8.57 62.55,8.57 62.55,9.69 R51.2 62.55,9.99 | R50.2 57.62,8.72 57.47,8.57 | R48.2 47.46,8.74 47.62,8.57 | R12.2 5.23,28.73 5.08,28.57 5.08,25.08 | 5.08,25.08 5.08,23.18 | 5.08,23.18 5.08,20.95 5.71,20.32 13.97,20.32 14.61,20.95 14.61,21.88 | 14.61,21.88 IC2.14 | R10.2 5.25,23.34 5.08,23.18 | R9.2 5.23,25.23 5.08,25.08 | 52.39,17.14 51.76,17.78 IC5.4 49.98,19.87 C23.1 | 65.67,58.12 67.61,58.12 67.63,58.1 67.63,49.85 v64.45,46.67 58.42,40.64 v54.61,40.64 53.02,42.23 43.81,42.23 43.18,42.86 IC4.20 43.18,45.4 43.02,45.57 C24.1 42.7,46.67 v37.78,46.67
  Top 0.61: R21.1 v73.34,67.94 | v84.14,67.31 85.89,65.56 C9.+ R6.1 | R21.1 72.07,67.78 72.07,66.67 v66.36,66.67 | C7.1 89.64,55.46 87.63,57.47 R6.1 | R3.1 83.35,53.82 85.89,56.36 R6.1 | C8.1 89.64,42.33 89.22,41.91 86.04,41.91 v85.09,40.96 | v25.72,44.13 25.72,42.86 R20.2 25.88,41.74 27.62,40.01 27.62,37.15 24.13,33.66 24.13,23.5 20.95,20.32 17.31,20.32 C12.1 17.14,21.27 16.51,21.91 14.61,21.91 14.61,21.88 | 52.54,8.57 R49.2 52.39,9.84 52.39,17.14
  Top 1.016: C7.1 89.64,49.02 L1.2 89.64,48.77 C8.1
  Bottom 0.61: v6.67,58.42 v6.67,62.23 10.16,65.72 v12.06,65.72 | v27.94,61.59 v23.5,61.59 | v36.51,52.39 v36.51,56.83 v36.51,61.28 v36.51,63.18 | v55.24,28.57 v51.12,28.57 | v28.57,49.85 28.57,48.9 27.3,47.62 27.3,45.72 | v37.78,46.67 36.51,46.67 33.97,44.13 28.89,44.13 27.3,45.72 | 27.3,45.72 v25.72,44.13 | v85.09,39.05 v85.09,40.96 | v54.61,33.34 v54.61,40.64 | v56.83,53.02 58.1,53.02 v64.45,46.67 | v73.34,67.94 76.83,67.94 77.47,67.31 v84.14,67.31 | v66.36,66.67 v63.5,63.82
+24V  (via drill 0.6 pad 0.6)
  Top 0.457: C1.1 76.41,48.26 IC1.4 78.12,47.94 D2.C
  Top 0.61: D3.C 26.55,24.25 27.62,23.18 30.48,23.18 | 30.48,23.18 32.38,23.18 | Q1.2 30.48,23.18 | 32.38,23.18 R17.2 | R15.2 76.03,10.96 73.03,13.97 73.03,23.81 69.22,27.62 v69.22,33.97 68.58,34.61 51.75,34.61 48.9,31.75 48.9,29.21 49.53,28.57 v49.53,25.4 | 32.38,23.18 33.34,23.18 v33.66,22.86 | v37.78,24.13 37.78,25.4 38.42,26.04 IC3.9 40.96,26.04 v41.59,25.4 | REL1.2 26.64,10.45 31.75,15.56 v31.75,19.68 | D1.C 72.38,65.09 73.18,64.3 C4.+ R1.1 | R1.1 | R1.1 73.18,50.96 73.98,50.16 C2.1 | C3.1 71.31,48.26 70.17,48.26 69.53,47.62 69.53,43.5 v72.39,40.64
  Top 1.016: C1.1 74.33,48.04 C2.1 C3.1
  Bottom 0.61: v37.78,24.13 36.51,22.86 v33.66,22.86 31.75,20.95 v31.75,19.68 | v49.53,25.4 v41.59,25.4 | v69.22,33.97 72.39,37.15 v72.39,40.64
BACKLIGHT
  Top 0.305: IC3.2 44.13,18.41 43.81,18.73 43.81,27.94 40.64,31.11 IC4.7
BACKLIGHT_GND  (via drill 0.6 pad 0.6)
  Top 0.61: IC3.15 36.51,18.41 33.02,21.91 27.3,21.91 25.08,24.13 25.08,33.34 28.57,36.83 28.57,40.32 27.3,41.59 27.3,44.45 26.04,45.72 26.04,47.62 v25.72,47.94
  Bottom 0.61: v25.72,47.94 22.61,47.94 LCD1.K
BOOST
  Top 0.457: IC1.7 83.82,49.53 84.14,49.85 84.61,49.85 C6.1
BUZZER  (via drill 0.4 pad 0.6)
  Top 0.305: IC4.25 36.83,46.35 36.2,46.99 31.43,46.99 31.11,46.67 31.11,42.86 32.07,41.91 32.07,33.34 32.38,33.02 35.56,33.02 37.47,31.11 37.47,29.84 v40.01,27.3 | IC3.1 43.81,17.14 43.18,17.78 43.18,26.99 v42.86,27.3
  Bottom 0.305: v40.01,27.3 v42.86,27.3
BUZZER_GND  (via drill 0.6 pad 0.6)
  Top 0.61: v39.37,15.88 39.37,17.11 IC3.16 | v45.4,7.3 47.94,7.3 48.26,7.62 63.18,7.62 63.82,8.26 X1.2
  Bottom 0.61: v39.37,15.88 41.59,15.88 42.86,14.61 42.86,11.11 45.4,8.57 v45.4,7.3
CNC  (via drill 0.4 pad 0.6)
  Top 0.305: IC10.4 80.96,28.89 80.33,28.26 73.98,28.26 72.71,29.53 72.71,36.83 v71.12,38.42 70.17,38.42 69.85,38.1 40.96,38.1 39.37,36.51 IC4.6 | R47.2 48.74,65.57 49.85,66.67 63.18,66.67 69.22,60.64 69.22,48.58 68.58,47.94 68.58,42.86 v71.12,40.32
  Bottom 0.305: v71.12,40.32 v71.12,38.42
CNC_IN
  Top 0.305: R44.1 R42.1 81.28,37.31 81.28,38.1 83.19,40.01 91.76,40.01 93.03,41.27 93.03,60.64 84.77,68.9 84.77,72.71 83.5,73.98 48.9,73.98 47.94,73.03 CON1.4
CNC_RC
  Top 0.305: IC10.3 82.23,31.43 82.55,31.75 82.55,32.54 C38.1 R44.2
DRIVES  (via drill 0.4 pad 0.6)
  Top 0.305: IC10.2 83.5,28.89 82.23,27.62 73.66,27.62 72.07,29.21 72.07,35.88 v70.48,37.47 45.72,37.47 44.45,36.2 IC4.10 | R46.2 53.82,65.57 54.29,66.04 62.87,66.04 68.58,60.33 68.58,48.9 67.94,48.26 67.94,42.23 v69.85,40.32
  Bottom 0.305: v70.48,37.47 69.85,38.1 v69.85,40.32
DRIVES_IN  (via drill 0.4 pad 0.6)
  Top 0.305: R43.1 R41.1 87,37.15 v87.63,37.78 | CON1.3 53.02,73.03 53.34,73.34 83.19,73.34 84.14,72.39 84.14,68.58 92.39,60.33 92.39,41.59 91.76,40.96 v87.63,40.96
  Bottom 0.305: v87.63,40.96 v87.63,37.78
DRIVES_RC
  Top 0.305: IC10.1 84.77,32.55 C37.1 R43.2
ENC1_A  (via drill 0.4 pad 0.6)
  Top 0.305: v25.4,39.37 17.78,39.37 17.46,39.05 17.46,31.75 18.73,30.48 21.27,30.48 21.59,30.16 21.59,26.04 21.27,25.72 IC2.4 | IC4.3 35.56,38.73 34.92,39.37 v34.29,39.37
  Bottom 0.305: v34.29,39.37 v25.4,39.37
ENC1_B  (via drill 0.4 pad 0.6)
  Top 0.305: v25.72,38.42 18.1,38.42 18.1,32.07 19.05,31.11 21.59,31.11 22.23,30.48 22.23,23.81 21.59,23.18 IC2.2 | IC4.2 v34.29,38.42
  Bottom 0.305: v34.29,38.42 v25.72,38.42
ENC1_PB  (via drill 0.4 pad 0.6)
  Top 0.305: IC4.4 36.83,39.05 35.56,40.32 v34.29,40.32 | v24.77,40.32 17.78,40.32 16.83,39.37 16.83,29.84 18.41,28.26 IC2.6
  Bottom 0.305: v34.29,40.32 v24.77,40.32
ENC1A
  Top 0.305: R8.1 C10.1 12.23,25.4 13.02,25.4 13.34,25.72 IC2.11
ENC1B
  Top 0.305: R11.2 C11.1 12.23,23.18 IC2.13
ENC1PB
  Top 0.305: R13.2 C13.1 12.22,28.57 13.02,28.57 13.34,28.26 IC2.9
ERROR
  Top 0.305: IC3.3 45.09,19.72 45.09,20.95 IC3.4 IC3.5 46.04,22.23 47.62,23.81 47.62,28.26 45.72,30.16 IC4.11
ERROR_NPN  (via drill 0.6 pad 0.6)
  Top 0.61: v29.84,46.67 29.84,46.35 29.21,45.72 29.21,42.55 30.48,41.27 30.48,32.7 31.75,31.43 34.92,31.43 35.88,30.48 35.88,21.27 37.47,19.68 IC3.14
  Bottom 0.61: CON1.5 42.86,68.42 40.96,66.52 39.05,66.52 37.78,65.25 37.78,52.07 36.83,51.12 34.29,51.12 v29.84,46.67
ERROR_PNP  (via drill 0.6 pad 0.6)
  Top 0.61: v28.57,46.67 28.26,46.35 28.26,41.91 29.53,40.64 29.53,31.43 | D4.C 29.53,31.43 | 29.53,31.43 29.53,29.18 D3.A 29.45,28.97 29.53,28.89 29.53,27.94 | 29.53,27.94 Q1.3 | R19.2 29.53,27.94
  Bottom 0.61: CON1.6 37.78,66.83 35.24,64.29 35.24,53.66 28.57,46.99 v28.57,46.67
GND  (via drill 0.5 pad 0.6, 0.6, 0.6 pad 0.6, 4.2 pad 7)
  other vias: 4,4 91,4 4,71 91,71 10.81,30.32 10.79,21.91 10.81,26.83 63.82,30.16 61.28,30.16 58.74,33.02 58.74,30.16 61.28,33.02 63.82,33.02 66.36,33.02 66.36,30.16 52.02,21.22 42.55,36.83 49.16,22.81 50.44,22.81 53.29,21.22 54.93,18.73 41.27,36.83 44.45,43.5 46.04,46.35 86.36,31.11 75.88,29.84 75.88,31.11 80.33,39.69 77.47,14.29 80.96,14.29 88.58,24.77 88.58,23.5 75.88,23.81 83.82,21.59 16.19,52.39 14.92,52.39 13.65,60.96 15.24,64.14 15.24,62.87 31.11,60.8 32.38,57.47 23.18,50.16 31.75,53.02 42.23,55.24 42.23,59.69 42.23,50.48 44.45,57.78 46.04,56.83 53.66,54.93 57.15,54.93 58.74,50.48 62.55,60.33 62.55,59.05 57.47,50.48 53.34,18.73 41.91,33.02 44.77,26.99 46.04,26.99 33.02,29.53 34.29,29.53 26.35,33.02 27.62,33.02 17.78,30.16 18.73,29.53 80.33,32.7 75.56,53.02 76.83,53.02 86.68,53.02 86.68,51.75 88.27,50.48 88.27,49.53 88.27,48.26 88.27,47.31 86.68,46.04 86.68,44.77 70.8,43.81 72.07,43.81 73.34,43.81 74.61,43.81 75.88,44.77 77.15,44.77 81.28,48.26 81.28,49.21 81.28,50.16 80.01,50.16 80.01,51.12 81.28,51.12 82.55,51.12 83.19,47.31 81.92,47.31 81.28,55.56 81.28,54.29 89.85,59.05 91.12,43.18 24.45,50.16
  pour Bottom (isolate 0.254, rank 3, no thermals): 93,0 2,0 arc-90 0,2 0,73 arc-90 2,75 93,75 arc-90 95,73 95,2 arc-90
  pour Top (isolate 0.254, rank 3, no thermals): 0,2 0,73 arc-90 2,75 93,75 arc-90 95,73 95,2 arc-90 93,0 2,0 arc-90
N$1
  Top 0.305: R5.1 78.42,54.61 78.42,52.87 R4.2 78.42,52.7 78.42,50.19 IC1.1
N$2
  Top 0.406: C20.1 58.64,25.16 LCD1.8
N$4
  Top 0.305: R4.1 R3.2
N$5
  Top 0.457: IC1.2 77.15,49.53 76.83,49.85 76.35,49.85 C5.1
N$6  (via drill 0.4 pad 0.6)
  Top 0.305: R36.1 21.58,64.61 v20.64,64.61
  Bottom 0.305: LED4.A v20.64,64.61
N$8  (via drill 0.4 pad 0.6)
  Top 0.305: R37.1 26.66,64.61 v25.72,64.61
  Bottom 0.305: LED5.A v25.72,64.61
N$11  (via drill 0.4 pad 0.6)
  Top 0.305: R38.1 31.74,64.61 v30.8,64.61
  Bottom 0.305: LED6.A v30.8,64.61
N$12
  Top 0.61: R15.1 X1.1
N$13  (via drill 0.4 pad 0.6)
  Top 0.305: R11.1 9.21,21.91 v7.94,21.91 6.83,21.91 R10.1
  Bottom 0.305: v7.94,21.91 7.94,25.4 6.99,26.35 6.99,37.44 SW1.B
N$14  (via drill 0.4 pad 0.6)
  Top 0.305: R9.1 6.67,26.67 v7.94,26.67 9.04,26.67 R8.2
  Bottom 0.305: SW1.A 12.5,35.99 7.94,31.43 v7.94,26.67
N$15
  Top 0.61: R20.1 24.28,42.08 26.67,39.69 26.67,37.47 23.81,34.61 20.94,34.61 LCD1.A
N$16
  Top 0.61: IC3.11 40.64,23.5 40.96,23.18 40.96,15.56 40.01,14.61 38.73,14.61 32.38,20.95 24.13,20.95 14.61,11.43 14.61,5.68 REL1.1
N$17
  Top 0.305: Q1.1 28.58,25.4 28.89,25.72 32.22,25.72 R17.1 R18.2
N$18
  Top 0.305: IC1.3 79.69,48.9 80.01,48.58 80.01,47.94 80.64,47.31 80.64,46.69 D2.A 80.64,46.65 80.64,46.04 80.11,45.5 R2.1
N$19
  Top 0.305: R13.1 R12.1 6.67,31.43 5.71,32.38 5.71,39.69 12.5,46.47 SW1.1
N$20  (via drill 0.4 pad 0.6)
  Top 0.305: R18.1 34.77,24.28 34.92,24.13 v34.92,21.59 | IC3.13 37.78,20.95 v37.15,21.59
  Bottom 0.305: v34.92,21.59 v37.15,21.59
N$21
  Top 0.305: R45.1 R39.1 R40.2
N$22
  Top 0.305: R56.2 R55.1 R52.1
N$23
  Top 0.305: R53.1 R57.1 R58.2
N$24
  Top 0.305: R54.1 R59.1 R60.2
N$25
  Top 0.406: C14.1 66.26,25.16 LCD1.2
N$26
  Top 0.406: C15.1 65.09,25.26 LCD1.3
N$27
  Top 0.406: C19.1 60.01,25.26 LCD1.7
N$28
  Top 0.406: C18.1 61.18,25.16 LCD1.6
N$29
  Top 0.406: C17.1 62.55,25.26 LCD1.5
N$30
  Top 0.406: C16.1 63.72,25.16 LCD1.4
N$31  (via drill 0.4 pad 0.6)
  Top 0.305: IC3.10 40.64,24.77 41.91,23.5 41.91,14.92 v41.27,14.29
  Bottom 0.305: v41.27,14.29 40.01,14.29 37.47,11.75 37.47,10.01 LED3.C
N$32  (via drill 0.4 pad 0.6)
  Top 0.305: R14.1 41.28,64.61 v42.23,64.61
  Bottom 0.305: LED2.A v42.23,64.61
N$33  (via drill 0.4 pad 0.6)
  Top 0.305: R16.1 v40.01,9.84
  Bottom 0.305: R16.1 v40.01,9.84
N$34  (via drill 0.4 pad 0.6)
  Top 0.305: v30.16,45.09 30.16,42.86 31.43,41.59 31.43,33.02 32.07,32.38 35.24,32.38 36.83,30.8 36.83,23.5 38.1,22.23 IC3.12
  Bottom 0.305: LED2.C 39.52,61.59 38.73,60.8 38.73,51.75 37.15,50.16 34.61,50.16 31.11,46.67 31.11,46.04 v30.16,45.09
N$35  (via drill 0.4 pad 0.6)
  Top 0.305: R7.1 59.68,64.61 v58.74,64.61
  Bottom 0.305: LED1.A v58.74,64.61
N$36  (via drill 0.4)
  Top 0.305: R46.1 LED7.A v50.96,64.61
  Bottom 0.305: LED7.A v50.96,64.61
N$37  (via drill 0.4 pad 0.6)
  Top 0.305: R47.1 46.98,64.61 v46.04,64.61
  Bottom 0.305: LED8.A v46.04,64.61
N$38  (via drill 0.4 pad 0.6)
  Top 0.305: LED9.A v50.16,9.84
  Bottom 0.305: LED9.A v50.16,9.84
N$39  (via drill 0.4)
  Top 0.406: v55.24,9.84 LED10.A
  Bottom 0.406: LED10.A v55.24,9.84
N$40  (via drill 0.4 pad 0.6)
  Top 0.305: LED11.A v60.33,9.84
  Bottom 0.305: LED11.A v60.33,9.84
N$41  (via drill 0.4)
  Top 0.406: v65.41,9.84 LED12.A
  Bottom 0.406: LED12.A v65.41,9.84
OIL  (via drill 0.4 pad 0.6)
  Top 0.305: IC10.6 78.42,29.21 78.11,28.89 74.61,28.89 73.66,29.84 73.66,37.47 71.75,39.37 70.17,39.37 69.53,38.73 40.32,38.73 38.1,36.51 IC4.5 38.1,30.48 42.55,26.04 42.55,13.02 45.72,9.84 v46.04,9.84
  Bottom 0.305: LED9.C v46.04,9.84
OIL_IN  (via drill 0.4 pad 0.6)
  Top 0.305: CON2.4 48.26,6.35 48.58,6.67 64.77,6.67 68.9,2.54 81.6,2.54 81.92,2.86 81.92,11.75 81.6,12.06 76.2,12.06 73.98,14.29 73.98,23.5 v74.3,23.81 | R39.2 v79.69,37.15
  Bottom 0.305: v74.3,23.81 77.79,27.3 77.79,35.24 v79.69,37.15
OIL_RC
  Top 0.305: R45.2 C39.1 79.06,32.55 79.06,32.07 79.69,31.43 IC10.5
PGC  (via drill 0.4 pad 0.6)
  Top 0.305: IC4.27 v34.29,46.04
  Bottom 0.305: CON3.5 80.33,72.71 79.85,73.18 46.99,73.18 45.72,71.91 45.72,67.79 44.45,66.52 44.45,63.5 40.64,59.69 40.64,50.8 37.78,47.94 36.2,47.94 v34.29,46.04
PGD  (via drill 0.4 pad 0.6)
  Top 0.305: IC4.28 v33.02,46.04
  Bottom 0.305: CON3.4 77.79,69.53 78.42,68.9 80.96,68.9 81.6,69.53 81.6,73.18 80.96,73.82 46.67,73.82 45.09,72.23 45.09,68.1 43.81,66.83 43.81,63.82 40.01,60.01 40.01,51.12 37.47,48.58 35.56,48.58 v33.02,46.04
PRESSURE1  (via drill 0.4)
  Top 0.305: IC10.12 82.23,26.35 81.6,26.99 73.34,26.99 71.44,28.89 71.44,35.24 69.85,36.83 47.62,36.83 46.99,36.2 IC4.12 46.99,29.84 48.26,28.57 48.26,18.1 51.44,14.92 v51.44,14.61
  Bottom 0.305: LED10.C 52.54,13.5 v51.44,14.61
PRESSURE1_IN
  Top 0.305: R55.2 84.45,18.1 83.82,17.46 83.82,1.59 82.87,0.64 54.29,0.64 53.34,1.59 CON2.5
PRESSURE1_RC
  Top 0.305: R52.2 C41.1 84.45,22.54 83.5,23.5 IC10.13
PRESSURE2  (via drill 0.4 pad 0.6)
  Top 0.305: IC10.10 79.69,26.04 79.38,26.35 73.98,26.35 v73.66,26.04 73.34,26.04 70.8,28.57 70.8,34.92 69.53,36.2 48.58,36.2 48.26,35.88 IC4.13 | v57.78,14.61 61.59,14.61 62.55,15.56 69.85,15.56 71.44,17.14 71.44,22.54 70.8,23.18 v70.8,23.81
  Bottom 0.305: LED11.C 57.78,9.84 v57.78,14.61 | v73.66,26.04 73.03,26.04 v70.8,23.81
PRESSURE2_IN
  Top 0.305: R57.2 80.01,18.1 79.69,17.78 79.69,13.97 80.33,13.34 82.55,13.34 83.19,12.7 83.19,1.91 82.55,1.27 58.74,1.27 58.42,1.59 CON2.6
PRESSURE2_RC
  Top 0.305: IC10.11 80.96,22.71 C42.1 R53.2
PRESSURE3  (via drill 0.4)
  Top 0.305: IC4.14 49.55,34.92 50.16,34.92 50.8,35.56 69.22,35.56 70.17,34.61 70.17,28.26 v73.66,24.77 77.15,24.77 IC10.8 | v63.18,14.61 69.85,14.61 72.07,16.83 72.07,23.18 v71.75,23.5
  Bottom 0.305: LED12.C 62.7,14.12 v63.18,14.61 | v71.75,23.5 72.39,23.5 v73.66,24.77
PRESSURE3_IN
  Top 0.305: R59.2 78.74,18.1 79.06,17.78 79.06,13.65 80.01,12.7 82.23,12.7 82.55,12.38 82.55,2.22 82.23,1.91 63.82,1.91 63.5,2.22 CON2.7
PRESSURE3_RC
  Top 0.305: IC10.9 78.42,23.81 77.79,23.18 77.79,22.7 C43.1 R54.2
PUMP
  Top 0.305: IC3.6 IC3.7 46.67,24.77 46.99,25.08 46.99,27.94 43.18,31.75 IC4.9
REL_COM
  Top 1.778: REL1.COM 20.64,2.22 21.59,1.27 28.57,1.27 29.53,2.22 29.53,6.35 31.11,7.94 35.24,7.94 38.1,5.08 CON2.2
REL_OFF
  Bottom 1.778: CON2.3 43.18,6.03 41.59,7.62 33.97,7.62 26.67,14.92 26.67,17.82 REL1.O
REL_ON
  Bottom 1.778: CON2.1 33.02,1.59 23.5,1.59 23.5,5.71 19.37,9.84 19.37,9.88 14.64,14.61 REL1.C
SCL  (via drill 0.4 pad 0.6)
  Top 0.305: IC4.22 40.64,42.55 41.91,41.27 52.7,41.27 53.34,40.64 v53.34,40.32 | v53.34,33.34 53.34,31.43 53.66,31.11 53.66,30.32 R23.2 53.66,30.16 53.66,29.21 53.5,29.05 LCD1.12 53.5,23.65 53.66,23.5 IC5.1
  Bottom 0.305: v53.34,33.34 v53.34,40.32
SDA  (via drill 0.4 pad 0.6)
  Top 0.305: IC4.23 39.37,42.23 41.27,40.32 v52.39,40.32 | v52.39,33.34 52.39,31.43 52.07,31.11 52.07,30.32 R22.2 52.07,30.16 52.07,29.21 52.23,29.05 LCD1.13 52.23,23.97 51.75,23.5 IC5.3
  Bottom 0.305: v52.39,40.32 v52.39,33.34
SWITCH1
  Top 0.457: IC1.6 83.82,48.9 84.14,48.58 84.61,48.58 C6.2
  Top 1.016: C6.2 86.28,48.41 L1.1
VIN
  Top 0.61: CON1.2 58.1,68.26 58.74,67.63 63.5,67.63 66.04,65.09 66.59,65.09 66.67,65.17 D1.A
X
  Top 0.305: IC8.1 IC7.13 IC7.2
X_IN
  Top 0.305: R24.1 R27.1 10.48,65.41 12.7,67.63 21.91,67.63 22.54,68.26 CON1.9
X_MOVING  (via drill 0.4 pad 0.6)
  Top 0.305: R36.2 23.34,63.34 25.4,61.28 25.4,49.53 27.3,47.62 46.35,47.62 46.99,46.99 IC4.17 46.99,43.5 47.31,43.18 50.16,43.18 50.8,43.81 v50.8,45.72 | IC9.3 61.59,55.56 62.23,54.93 62.23,48.9 61.91,48.58 53.02,48.58 v52.7,48.9
  Bottom 0.305: v50.8,45.72 50.8,46.99 v52.7,48.9
X_OC
  Top 0.305: IC8.16 29.53,60.36 29.53,61.59 30.16,62.23 38.1,62.23 38.42,61.91 R30.1 C30.1 40.64,61.28 53.02,61.28 53.34,60.96 IC6.1
X_RC
  Top 0.305: R27.2 C25.1 13.5,62.38 14.29,61.59 IC7.1
X_WAS_HIGH
  Top 0.305: IC6.2 52.07,57.78 52.39,57.47 58.1,57.47 58.74,58.1 IC9.1
Y
  Top 0.305: IC8.3 IC7.11 IC7.4
Y_IN
  Top 0.305: R28.1 R25.1 8.1,60.33 5.71,60.33 5.4,60.64 5.4,63.5 10.16,68.26 19.37,68.26 20.32,69.22 20.32,72.39 21.27,73.34 27.3,73.34 27.62,73.03 CON1.8
Y_MOVING  (via drill 0.4 pad 0.6)
  Top 0.305: IC4.16 v48.26,47.62 47.62,48.26 27.62,48.26 26.04,49.85 26.04,61.91 27.62,63.5 28.26,63.5 28.57,63.82 28.57,64.62 R37.2 | IC9.6 61.28,51.75 61.59,51.44 61.59,49.53 61.28,49.21 53.66,49.21 53.02,49.85 52.39,49.85 v51.75,49.21
  Bottom 0.305: v51.75,49.21 50.16,47.62 v48.26,47.62
Y_OC
  Top 0.305: IC8.14 31.11,57.78 31.75,58.42 33.66,58.42 34.29,57.78 38.1,57.78 38.42,57.47 R32.1 C32.1 40.79,56.83 41.91,56.83 45.09,60.01 47.94,60.01 48.26,59.69 IC6.5
Y_RC
  Top 0.305: R28.2 C26.1 13.49,58.57 13.97,59.05 IC7.3
Y_WAS_HIGH
  Top 0.305: IC6.6 46.99,56.52 47.31,56.2 57.15,56.2 59.05,54.29 IC9.4
Z
  Top 0.305: IC8.5 IC7.9 IC7.6
Z_IN
  Top 0.305: R29.1 R26.1 8.09,54.93 5.71,54.93 4.76,55.88 4.76,63.82 9.84,68.9 19.05,68.9 19.68,69.53 19.68,72.71 20.95,73.98 31.75,73.98 32.7,73.03 CON1.7
Z_MOVING
  Top 0.305: R38.2 33.5,63.35 33.02,62.87 27.94,62.87 26.67,61.59 26.67,50.16 27.94,48.9 48.9,48.9 49.53,48.26 49.53,46.67 | 49.53,46.67 IC4.15 | IC9.11 64.77,54.29 64.14,53.66 64.14,47.94 62.87,46.67 49.53,46.67
Z_OC
  Top 0.305: IC8.12 30.8,55.24 31.43,54.61 31.43,54.29 31.75,53.98 35.24,53.98 35.88,53.34 38.1,53.34 38.42,53.02 R34.1 40.48,52.23 40.64,52.07 C35.1 41.76,52.23 44.45,54.93 49.21,54.93 49.53,54.61 IC6.11
Z_RC
  Top 0.305: R29.2 C27.1 12.85,56.52 IC7.5
Z_WAS_HIGH
  Top 0.305: IC9.13 63.82,56.83 62.87,55.88 62.87,48.58 62.23,47.94 51.12,47.94 50.8,48.26 50.8,48.9 48.26,51.44 IC6.10

### Text on the board
tPlace: Nov 2020 | Central Lubrication Controller | soldernerd.com | Lukas Fässler
bPlace: ICSP | P | N | + | - | X | Y | Z | ERROR | CNC | DRV | 24V | Central Lubrication Controller | soldernerd.com | PUMP RELAY | OIL | PR1 | PR2 | PR3 | ON | OFF